# EAGLE design lte_cat_m1_shield_sara-r4 (EAGLE 9.5.1)

## Sheet 1 of 2
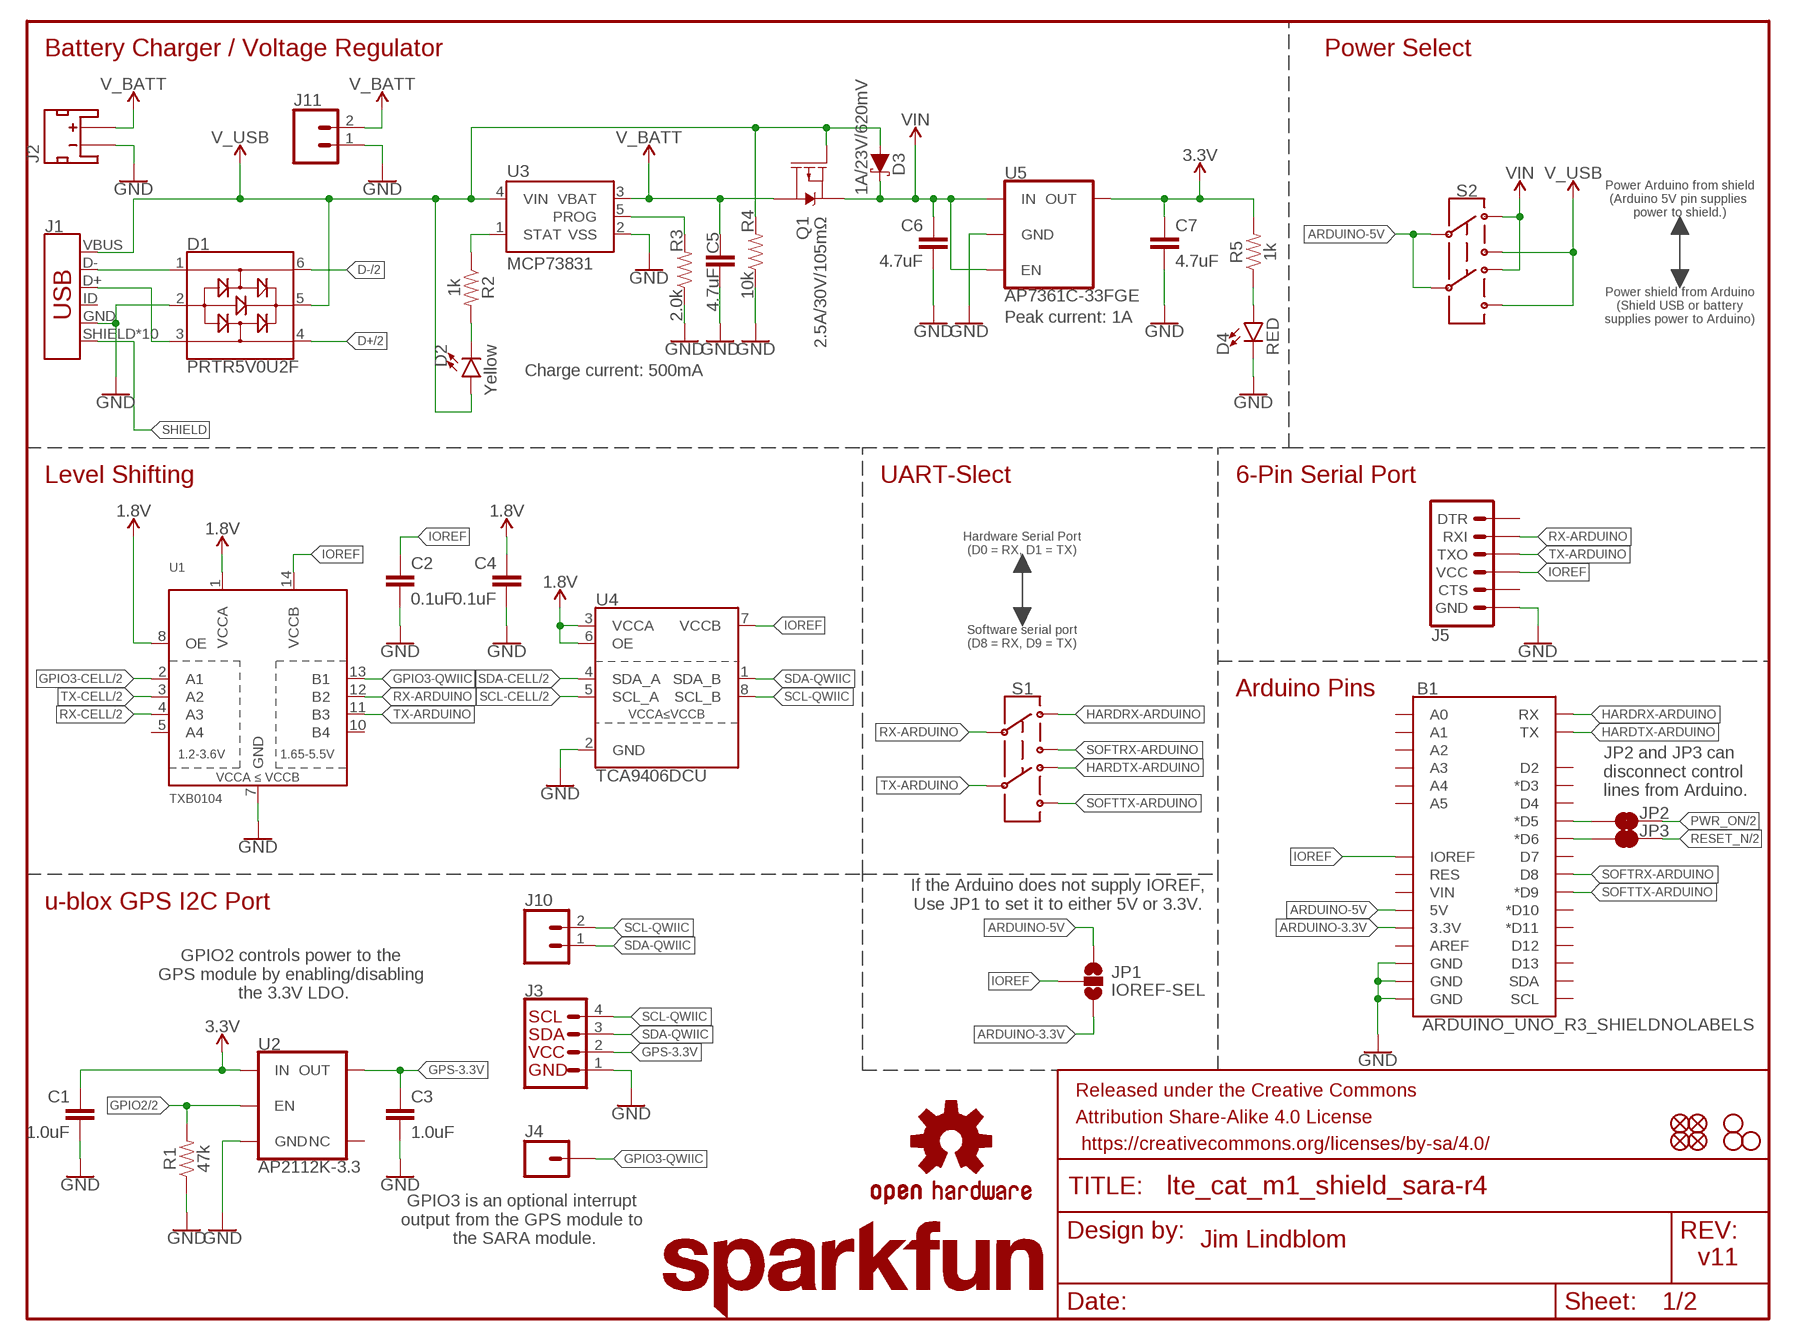
[diagram p0: schematic, sheet 1]

### Parts
B1  ARDUINO_UNO_R3_SHIELDNOLABELS  [UNO_R3_SHIELD_NOLABELS]
C1  1.0uF  1.0UF-0603-16V-10%  [0603]
C2  0.1uF  0.1UF-0603-25V-(+80/-20%)  [0603]
C3  1.0uF  1.0UF-0603-16V-10%  [0603]
C4  0.1uF  0.1UF-0603-25V-(+80/-20%)  [0603]
C5  4.7uF  4.7UF-0603-6.3V-(10%)  [0603]
C6  4.7uF  4.7UF-0603-6.3V-(10%)  [0603]
C7  4.7uF  4.7UF-0603-6.3V-(10%)  [0603]
D1  PRTR5V0U2F  [SOT886]
D2  Yellow  LED-YELLOW0603  [LED-0603]
D3  1A/23V/620mV  DIODE-SCHOTTKY-BAT20J  [SOD-323]
D4  RED  LED-RED0603  [LED-0603]
FD1  FIDUCIALUFIDUCIAL  [FIDUCIAL-MICRO]
FD2  FIDUCIALUFIDUCIAL  [FIDUCIAL-MICRO]
FD3  FIDUCIALUFIDUCIAL  [FIDUCIAL-MICRO]
FD4  FIDUCIALUFIDUCIAL  [FIDUCIAL-MICRO]
FRAME1  FRAME-LETTER  [CREATIVE_COMMONS]
H1  STAND-OFF  [STAND-OFF]
H2  STAND-OFF  [STAND-OFF]
H3  STAND-OFF  [STAND-OFF]
J1  USB_MICRO-B_HALF_PTH_MILL  [USB-MICROB-PTH-MILL]
J2  JST_2MM_MALESMD  [JST-2-SMD]
J3  QWIIC_CONNECTORJS-1MM  [1X04_1MM_RA]
J4  CONN_01PTH_NO_SILK_YES_STOP  [1X01_NO_SILK]
J5  6_PIN_SERIAL_TARGETNO_SILK  [1X06_NO_SILK]
J10  CONN_021X02_NO_SILK  [1X02_NO_SILK]
J11  CONN_021X02_NO_SILK  [1X02_NO_SILK]
JP1  IOREF-SEL  JUMPER-SMT_3_NO_SILK  [SMT-JUMPER_3_NO_SILK]
JP2  JUMPER-SMT_2_NC_TRACE_SILK  [SMT-JUMPER_2_NC_TRACE_SILK]
JP3  JUMPER-SMT_2_NC_TRACE_SILK  [SMT-JUMPER_2_NC_TRACE_SILK]
LOGO1  SFE_LOGO_NAME.2_INCH  [SFE_LOGO_NAME_.2]
LOGO2  OSHW-LOGOM  [OSHW-LOGO-M]
LOGO3  SFE_LOGO_NAME.2_INCH  [SFE_LOGO_NAME_.2]
Q1  2.5A/30V/105mΩ  MOSFET_PCH-DMG2307L  [SOT23-3]
R1  47k  47KOHM-0603-1/10W-1%  [0603]
R2  1k  1KOHM-0603-1/10W-1%  [0603]
R3  2.0k  2.0KOHM-0603-1/10W-5%  [0603]
R4  10k  10KOHM-0603-1/10W-1%  [0603]
R5  1k  1KOHM-0603-1/10W-1%  [0603]
S1  SWITCH-DPDT-SMD-AYZ0202  [SWITCH_DPDT_SMD_AYZ0202]
S2  SWITCH-DPDT-SMD-AYZ0202  [SWITCH_DPDT_SMD_AYZ0202]
U1  TXB0104  TXB0104PWR  [TSSOP14]
U2  AP2112K-3.3  V_REG_AP2112K-3.3V  [SOT23-5]
U3  MCP73831  [SOT23-5]
U4  TCA9406DCU  [VSSOP-8]
U5  AP7361C-33FGE  [8-UDFN]

### Nets
1.8V: C4.1 U1.1(VCCA) U1.8(OE) U4.3(VCCA) U4.6(OE) ; also sheet 2
3.3V: C1.1 C7.1 R5.2 U2.1(IN) U5.1(OUT) ; also sheet 2
ARDUINO-3.3V: B1.3.3V JP1.3
ARDUINO-5V: B1.5V JP1.1 S2.2 S2.5
D+ [USB_Data]: D1.4 ; also sheet 2
D- [USB_Data]: D1.6 ; also sheet 2
GND: B1.GND@0(GND) B1.GND@1(GND) B1.GND@2(GND) C1.2 C2.2 C3.2 C4.2 C5.2 C6.2 C7.2 D1.2 D4.C J1.GND J2.1(-) J3.1 J5.6(GND) J11.1 R1.1 R3.1 R4.1 U1.7(GND) U2.2(GND) U3.2(VSS) U4.2(GND) U5.4(GND) U5.EP(GND) ; also sheet 2
GPIO2: R1.2 U2.3(EN) ; also sheet 2
GPIO3-CELL: U1.2(A1) ; also sheet 2
GPIO3-QWIIC: J4.1 U1.13(B1)
GPS-3.3V: C3.1 J3.2 U2.5(OUT)
HARDRX-ARDUINO: B1.RX S1.1
HARDTX-ARDUINO: B1.TX S1.4
IOREF: B1.IOREF C2.1 J5.4(VCC) JP1.2 U1.14(VCCB) U4.7(VCCB)
N$1: R3.2 U3.5(PROG)
N$12: D1.1 J1.D-
N$14: D1.3 J1.D+
N$16: D4.A R5.1
N$17: D2.C R2.2
N$18: R2.1 U3.1(STAT)
N$19: B1.D5(*D5) JP2.1
N$20: B1.D6(*D6) JP3.1
PWR_ON: JP2.2 ; also sheet 2
RESET_N: JP3.2 ; also sheet 2
RX-ARDUINO: J5.2(RXI) S1.2 U1.12(B2)
RX-CELL: U1.4(A3) ; also sheet 2
SCL-CELL: U4.5(SCL_A) ; also sheet 2
SCL-QWIIC: J3.4 J10.2 U4.8(SCL_B)
SDA-CELL: U4.4(SDA_A) ; also sheet 2
SDA-QWIIC: J3.3 J10.1 U4.1(SDA_B)
SHIELD: J1.SHIELD J1.SHIELD2(SHIELD) J1.SHIELD3(SHIELD) J1.SHIELD4(SHIELD) J1.SHIELD5(SHIELD) J1.SHIELD6(SHIELD) J1.SHIELD7(SHIELD) J1.SHIELD8(SHIELD) J1.SHIELD9(SHIELD) J1.SHIELD10(SHIELD)
SOFTRX-ARDUINO: B1.D8 S1.3
SOFTTX-ARDUINO: B1.D9(*D9) S1.6
TX-ARDUINO: J5.3(TXO) S1.5 U1.11(B3)
TX-CELL: U1.3(A2) ; also sheet 2
V_BATT: C5.1 J2.2(+) J11.2 Q1.3(D) U3.3(VBAT)
V_USB: D1.5 D2.A D3.A J1.VBUS Q1.1(G) R4.2 S2.3 S2.6 U3.4(VIN) ; also sheet 2
VIN: C6.1 D3.C Q1.2(S) S2.1 S2.4 U5.5(EN) U5.8(IN)
Unconnected: B1.A0 B1.A1 B1.A2 B1.A3 B1.A4 B1.A5 B1.AREF B1.D2 B1.D3(*D3) B1.D4 B1.D7 B1.D10(*D10) B1.D11(*D11) B1.D12 B1.D13 B1.RES B1.SCL B1.SDA B1.VIN J1.ID J5.1(DTR) J5.5(CTS) U1.5(A4) U1.10(B4) U2.4(NC)

### Notes on the sheet
- Battery Charger / Voltage Regulator | Power Select
- Power Arduino from shield
  (Arduino 5V pin supplies 
  power to shield.)
- Power shield from Arduino
  (Shield USB or battery
  supplies power to Arduino)
- Peak current: 1A
- Charge current: 500mA
- Level Shifting | UART-Slect | 6-Pin Serial Port
- Hardware Serial Port
  (D0 = RX, D1 = TX)
- Software serial port
  (D8 = RX, D9 = TX)
- Arduino Pins
- JP2 and JP3 can
  disconnect control 
  lines from Arduino.
- u-blox GPS I2C Port
- If the Arduino does not supply IOREF,
  Use JP1 to set it to either 5V or 3.3V.
- GPIO2 controls power to the 
  GPS module by enabling/disabling 
  the 3.3V LDO.
- GPIO3 is an optional interrupt 
  output from the GPS module to 
  the SARA module.
- Jim Lindblom
- v11

## Sheet 2 of 2
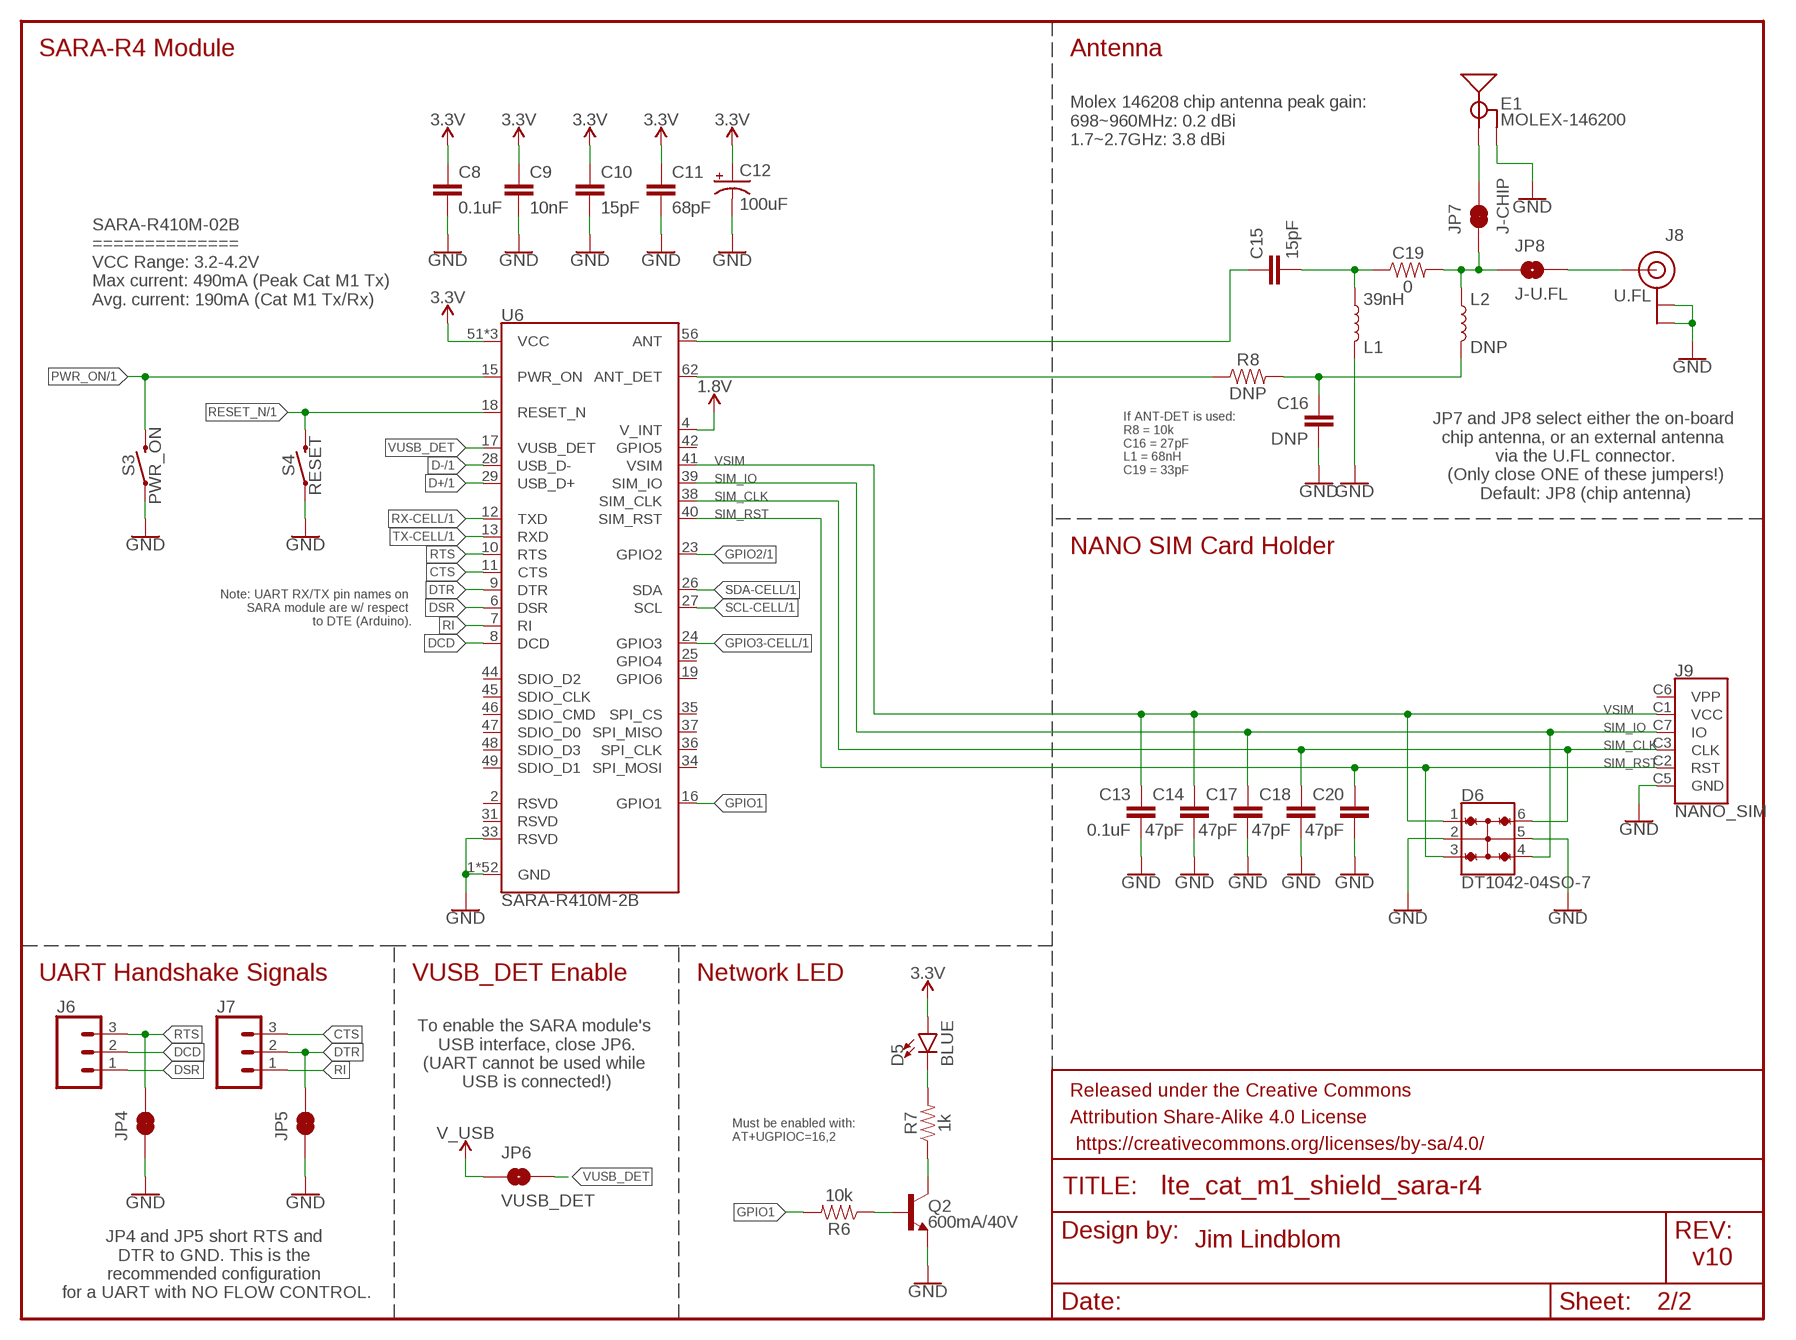
[diagram p1: schematic, sheet 2]

### Parts
C8  0.1uF  0.1UF-0603-25V-(+80/-20%)  [0603]
C9  10nF  10NF-0603-50V-10%  [0603]
C10  15pF  15PF-0603-50V-5%  [0603]
C11  68pF  68PF-0603-50V-5%  [0603]
C12  100uF  100UF-POLAR-1206-6.3V-20%  [1206-POLAR]
C13  0.1uF  0.1UF-0603-25V-(+80/-20%)  [0603]
C14  47pF  47PF-0603-50V-5%  [0603]
C15  15pF  15PF-0603-50V-5%  [0603]
C16  DNP  27PF-0603-50V-5%  [0603]
C17  47pF  47PF-0603-50V-5%  [0603]
C18  47pF  47PF-0603-50V-5%  [0603]
C19  0  0OHM-0603-1/10W-5%  [0603]
C20  47pF  47PF-0603-50V-5%  [0603]
D5  BLUE  LED-BLUE0603  [LED-0603]
D6  DT1042-04SO-7  TVS_DIODE_ARRAY_4DT1042-04SO-7  [SOT23-6L]
E1  MOLEX-146200  ANTENNA-GROUNDEDMOLEX-146200  [MOLEX_146200]
FRAME2  FRAME-LETTER  [CREATIVE_COMMONS]
J6  CONN_031X03_NO_SILK  [1X03_NO_SILK]
J7  CONN_031X03_NO_SILK  [1X03_NO_SILK]
J8  U.FL  [U.FL]
J9  NANO_SIM  NANO_SIMWURTH  [NANO_SIM_WURTH_693043020611]
JP4  JUMPER-SMT_2_NC_TRACE_SILK  [SMT-JUMPER_2_NC_TRACE_SILK]
JP5  JUMPER-SMT_2_NC_TRACE_SILK  [SMT-JUMPER_2_NC_TRACE_SILK]
JP6  VUSB_DET  JUMPER-SMT_2_NO_SILK  [SMT-JUMPER_2_NO_SILK]
JP7  J-CHIP  JUMPER-SMT_2_NC_TRACE_NO-SILK  [SMT-JUMPER_2_NC_TRACE_NO-SILK]
JP8  J-U.FL  JUMPER-SMT_2_NO_NO-SILK  [SMT-JUMPER_2_NO_NO-SILK]
L1  39nH  INDUCTOR-0603-39NH  [0603]
L2  DNP  INDUCTOR-0603-68NH  [0603]
Q2  600mA/40V  TRANS_NPN-MMBT2222AL  [SOT23-3]
R6  10k  10KOHM-0603-1/10W-1%  [0603]
R7  1k  1KOHM-0603-1/10W-1%  [0603]
R8  DNP  10KOHM-0603-1/10W-1%  [0603]
S3  PWR_ON  MOMENTARY-SWITCH-SPST-SMD-5.2-REDUNDANT  [TACTILE_SWITCH_SMD_5.2MM]
S4  RESET  MOMENTARY-SWITCH-SPST-SMD-5.2-REDUNDANT  [TACTILE_SWITCH_SMD_5.2MM]
U6  SARA-R410M-2B  SARA-R4  [SARA-LGA]

### Nets
1.8V: U6.4(V_INT) ; also sheet 1
3.3V: C8.1 C9.1 C10.1 C11.1 C12.1(+) D5.A U6.51(VCC) U6.52(VCC) U6.53(VCC) ; also sheet 1
ANT: C15.1 U6.56(ANT)
ANT_DET: R8.1 U6.62(ANT_DET)
CTS: J7.3 U6.11(CTS)
D+ [USB_Data]: U6.29(USB_D+) ; also sheet 1
D- [USB_Data]: U6.28(USB_D-) ; also sheet 1
DCD: J6.2 U6.8(DCD)
DSR: J6.1 U6.6(DSR)
DTR: J7.2 JP5.2 U6.9(DTR)
GND: C8.2 C9.2 C10.2 C11.2 C12.2(-) C13.2 C14.2 C16.2 C17.2 C18.2 C20.2 D6.2 D6.5 E1.GND J8.1(GND) J8.2(GND) J9.C5(GND) JP4.1 JP5.1 L1.1 Q2.2(E) S3.1 S3.2 S4.1 S4.2 U6.1(GND) U6.3(GND) U6.5(GND) U6.14(GND) U6.20(GND) U6.21(GND) U6.22(GND) U6.30(GND) U6.32(GND) U6.33(RSVD) U6.43(GND) U6.50(GND) U6.54(GND) U6.55(GND) U6.57(GND) U6.58(GND) U6.59(GND) U6.60(GND) U6.61(GND) U6.63(GND) U6.64(GND) U6.65(GND) U6.66(GND) U6.67(GND) U6.68(GND) U6.69(GND) U6.70(GND) U6.71(GND) U6.72(GND) U6.73(GND) U6.74(GND) U6.75(GND) U6.76(GND) U6.77(GND) U6.78(GND) U6.79(GND) U6.80(GND) U6.81(GND) U6.82(GND) U6.83(GND) U6.84(GND) U6.85(GND) U6.86(GND) U6.87(GND) U6.88(GND) U6.89(GND) U6.90(GND) U6.91(GND) U6.92(GND) U6.93(GND) U6.94(GND) U6.95(GND) U6.96(GND) ; also sheet 1
GPIO1: R6.2 U6.16(GPIO1)
GPIO2: U6.23(GPIO2) ; also sheet 1
GPIO3-CELL: U6.24(GPIO3) ; also sheet 1
N$7: C16.1 L2.2 R8.2
N$8: C15.2 C19.1 L1.2
N$9: J8.FEED(SIGNAL) JP8.2
N$10: Q2.1(B) R6.1
N$13: D5.C R7.2
N$15: Q2.3(C) R7.1
N$21: C19.2 JP7.1 JP8.1 L2.1
N$22: E1.FEED(SIGNAL) JP7.2
PWR_ON: S3.3 S3.4 U6.15(PWR_ON) ; also sheet 1
RESET_N: S4.3 S4.4 U6.18(RESET_N) ; also sheet 1
RI: J7.1 U6.7(RI)
RTS: J6.3 JP4.2 U6.10(RTS)
RX-CELL: U6.12(TXD) ; also sheet 1
SCL-CELL: U6.27(SCL) ; also sheet 1
SDA-CELL: U6.26(SDA) ; also sheet 1
SIM_CLK: C18.1 D6.6 J9.C3(CLK) U6.38(SIM_CLK)
SIM_IO: C17.1 D6.4 J9.C7(IO) U6.39(SIM_IO)
SIM_RST: C20.1 D6.3 J9.C2(RST) U6.40(SIM_RST)
TX-CELL: U6.13(RXD) ; also sheet 1
V_USB: JP6.1 ; also sheet 1
VSIM: C13.1 C14.1 D6.1 J9.C1(VCC) U6.41(VSIM)
VUSB_DET: JP6.2 U6.17(VUSB_DET)
Unconnected: J9.C6(VPP) U6.2(RSVD) U6.19(GPIO6) U6.25(GPIO4) U6.31(RSVD) U6.34(SPI_MOSI) U6.35(SPI_CS) U6.36(SPI_CLK) U6.37(SPI_MISO) U6.42(GPIO5) U6.44(SDIO_D2) U6.45(SDIO_CLK) U6.46(SDIO_CMD) U6.47(SDIO_D0) U6.48(SDIO_D3) U6.49(SDIO_D1)

### Notes on the sheet
- SARA-R4 Module | Antenna
- Molex 146208 chip antenna peak gain: 
  698~960MHz: 0.2 dBi
  1.7~2.7GHz: 3.8 dBi
- SARA-R410M-02B
  ==============
  VCC Range: 3.2-4.2V
  Max current: 490mA (Peak Cat M1 Tx)
  Avg. current: 190mA (Cat M1 Tx/Rx)
- If ANT-DET is used:
  R8 = 10k
  C16 = 27pF
  L1 = 68nH
  C19 = 33pF
- JP7 and JP8 select either the on-board 
  chip antenna, or an external antenna 
  via the U.FL connector.
  (Only close ONE of these jumpers!)
  Default: JP8 (chip antenna)
- NANO SIM Card Holder
- Note: UART RX/TX pin names on 
  SARA module are w/ respect 
  to DTE (Arduino).
- UART Handshake Signals | VUSB_DET Enable | Network LED
- To enable the SARA module's 
  USB interface, close JP6.
  (UART cannot be used while 
  USB is connected!)
- Must be enabled with:
  AT+UGPIOC=16,2
- JP4 and JP5 short RTS and 
  DTR to GND. This is the 
  recommended configuration 
  for a UART with NO FLOW CONTROL.
- Jim Lindblom
- v10

## Library data of the parts
B1 = SparkFun-Boards:ARDUINO_UNO_R3_SHIELD: Arduino R3 Shield Footprint Shield form compatible with the Arduino Uno R3. SparkFun Products: MG2639 Cellular Shield <https://www.sparkfun.com/products/13120> MIDI Shield <https://www.sparkfun.com/products/12898> R3 Stackable Headers Kit <https://www.sparkfun.com/products/11417>
C1 C3 = SparkFun-Capacitors:1.0UF: 1µF ceramic capacitors A capacitor is a passive two-terminal electrical component used to store electrical energy temporarily in an electric field.; PROD_ID: CAP-00868
C2 C4 C8 C13 = SparkFun-Capacitors:0.1UF: 0.1µF ceramic capacitors A capacitor is a passive two-terminal electrical component used to store electrical energy temporarily in an electric field.; PROD_ID: CAP-00810
C5-C7 = SparkFun-Capacitors:4.7UF: 4.7µF ceramic capacitors A capacitor is a passive two-terminal electrical component used to store electrical energy temporarily in an electric field.; PROD_ID: CAP-08280
C9 = SparkFun-Capacitors:10NF: 0.01uF/10nF/10,000pF ceramic capacitors A capacitor is a passive two-terminal electrical component used to store electrical energy temporarily in an electric field. CAP-09321; PROD_ID: CAP-00867
C10 C15 = SparkFun-Capacitors:15PF: 15pF ceramic capacitors A capacitor is a passive two-terminal electrical component used to store electrical energy temporarily in an electric field.; PROD_ID: CAP-07881
C11 = ublox:68PF: 68pF ceramic capacitors A capacitor is a passive two-terminal electrical component used to store electrical energy temporarily in an electric field.; PROD_ID: CAP-14092
C12 = ublox:100UF-POLAR: 100µF polarized capacitors A capacitor is a passive two-terminal electrical component used to store electrical energy temporarily in an electric field.; PROD_ID: CAP-14093
C14 C17 C18 C20 = SparkFun-Capacitors:47PF: 47pF ceramic capacitors A capacitor is a passive two-terminal electrical component used to store electrical energy temporarily in an electric field.; PROD_ID: CAP-08913
C16 = SparkFun-Capacitors:27PF: 27pF ceramic capacitors A capacitor is a passive two-terminal electrical component used to store electrical energy temporarily in an electric field.; PROD_ID: CAP-09989; VALUE: 27pF
C19 = SparkFun-Resistors:0OHM: 0Ω resistor A resistor is a passive two-terminal electrical component that implements electrical resistance as a circuit element. Resistors act to reduce current flow, and, at the same time, act to lower voltage levels within circuits. - Wikipedia; PROD_ID: RES-08609
D1 = ublox:PRTR5V0U2; PROD_ID: DIO-14084
D2 = SparkFun-LED:LED-YELLOW: Yellow SMD LED Used in manufacturing several products at SparkFun. Packages: 0603 - SMD 0603 package[Product Link] <http://www.kingbrightusa.com/product.asp?catalog_name=LED&product_id=APT1608SYCK> 0603 -SMART - SMART SMD 0603 package (more efficient/more expensive) [Product Link] <http://www.osram-os.com/osram_os/en/products/product-catalog/led-light-emitting-diodes/smartled-0603/ly-l29k/index.jsp> LilyPad - SMD1206 package[Product Datasheet] <https://www.sparkfun.com/datasheets/DevTools/LilyPad/Q150YUS4.pdf> SparkFun Products: Blynk Board <https://www.sparkfun.com/products/13794> IOIO-OTG <https://www.sparkfun.com/products/13613> XBee Explorer Serial <https://www.sparkfun.com/products/13225>; PROD_ID: DIO-09003
D3 = SparkFun-DiscreteSemi:DIODE-SCHOTTKY: Schottky diode A Schottky diode is a semiconductor diode which has a low forward voltage drop and a very fast switching action.; PROD_ID: DIO-11623
D4 = SparkFun-LED:LED-RED: Red SMD LED Used in manufacturing of most products at SparkFun Packages: 0603 - SMD 0603 package [Product Link] <http://docs.avagotech.com/docs/AV02-0551EN> 0603 SMART - SMD 0603 SMART package ( more efficient and expensive)[Product Link] <http://www.osram-os.com/Graphics/XPic2/00077099_0.pdf> 1206 - SMD1206 package [Product Link] <https://www.sparkfun.com/datasheets/DevTools/LilyPad/Q150OVS4.pdff> SparkFun Products: Pro Mini 328 -5V <https://www.sparkfun.com/products/821> RedBoard <https://www.sparkfun.com/products/12757> IOIO-OTG <https://www.sparkfun.com/products/13613>; PROD_ID: DIO-00819
D5 = SparkFun-LED:LED-BLUE: Blue SMD LED Used in manufacturing of various products at SparkFun Packages: 0603 - SMD 0603 package [Product Link] <http://www.digikey.com/product-detail/en/SMLE12BC7TT86/511-1589-2-ND/1641808> 1206 - SMD1206 package [Product Link] <http://www.digikey.com/product-detail/en/lite-on-inc/LTST-C150TBKT/160-1643-1-ND/573584> SparkFun Products: ESP8266 Thing-Dev Board <https://www.sparkfun.com/products/13711> RedBoard <https://www.sparkfun.com/products/12757>; PROD_ID: DIO-08575
D6 = ublox:TVS_DIODE_ARRAY_4; PROD_ID: DIO-14095
E1 = ublox:ANTENNA-GROUNDED: Antenna w/ Ground Connection 2.4GHz antennae with signal and ground terminals. TRACE_ANTENNA_2.4GHZ_15.2MM - Meander Trace antenna 15.2 x 5.7mm footprint Based on layout from TI app note AN043 <http://www.ti.com/lit/an/swra117d/swra117d.pdf>. TRACE_ANTENNA_2.4GHZ_25.7MM - Inverted F trace antenna 25.7 x 7.5 mm footprint. Based on layout from TI design note DN0007 <http://www.ti.com/lit/an/swru120b/swru120b.pdf>.; PROD_ID: ANT-14096
FD1-FD4 = SparkFun-Aesthetics:FIDUCIAL: Fiducial Alignment Points Point-of-reference for pick-and-place machines and other optical instruments.
FRAME1 FRAME2 = SparkFun-Aesthetics:FRAME-LETTER: Schematic Frame - Letter Standard 8.5x11 US Letter frame
H1-H3 = SparkFun-Hardware:STAND-OFF: Stand Off Drill holes for mechanically mounting via screws, standoffs, etc. Note: Use the keepout ring to avoid running the screw head into surrounding components. Variant Overviews STAND-OFF - Mechanical footprint for a #4 phillips button head screw. STAND-OFF-TIGHT - Mechanical footprint for a #4 phillips button head screw, Example SparkFun Products Screw - Phillips Head (1/4", 4-40, 10 pack) <https://www.sparkfun.com/products/10453> (PRT-10453) Screw - Phillips Head (1/2", 4-40, 10 pack) <https://www.sparkfun.com/products/10452> (PRT-10452) Screw - Phillips Head (3/4", 4-40, 10 pack) <https://www.sparkfun.com/products/10451> (PRT-10451) Screw - Phillips Head (1", 4-40, 10 pack) <https://www.sparkfun.com/products/10450> (PRT-10450)
J1 = SparkFun-Connectors:USB_MICRO-B: USB Type Micro-B Connector Male/female and PTH/SMT variants SparkFun Products: SparkFun microB USB Breakout <https://www.sparkfun.com/products/12035> SparkFun USB microB Plug Breakout <https://www.sparkfun.com/products/10031> SparkFun ESP8266 Thing <https://www.sparkfun.com/products/13231>; PROD_ID: CONN-13711
J2 = SparkFun-Connectors:JST_2MM_MALE: JST 2MM MALE RA CONNECTOR Two pin, compact surface mount connector. Commonly used as a battery input connection point. We really like the solid locking feeling and high current rating on these small connectors. We use these all the time as battery connectors. Mates to single-cell LiPo batteries. Here is the connector we sell at SparkFun: JST Right Angle Connector - White <https://www.sparkfun.com/products/8612> (PRT-08612) Datasheet <http://www.sparkfun.com/datasheets/Prototyping/Connectors/JST-Horizontal.pdf> It was used on these SparkFun products: SparkFun MOSFET Power Controller <https://www.sparkfun.com/products/11214> (PRT-11214) SparkFun Battery Babysitter - LiPo Battery Manager <https://www.sparkfun.com/products/13777> (PRT-13777) And many, many others that required a lipo battery connection.; PROD_ID: CONN-11443; SF_ID: PRT-08612
J3 = SparkFun-Connectors:QWIIC_CONNECTOR: SparkFun I2C Standard Qwiic Connector An SMD 1mm pitch JST connector makes it easy and quick (get it? Qwiic?) to connect I2C devices to each other. The Qwiic system <http://www.sparkfun.com/qwiic> enables fast and solderless connection between popular platforms and various sensors and actuators. We carry 200mm <https://www.sparkfun.com/products/14204>, 100mm <https://www.sparkfun.com/products/14205>, 50mm <https://www.sparkfun.com/products/14206>, and breadboard friendly <https://www.sparkfun.com/products/14207> Qwiic cables. We also offer 10 pcs strips <https://www.sparkfun.com/products/14323> the SMD connectors.; PROD_ID: CONN-13694
J4 = SparkFun-Connectors:CONN_01: Single connection point. Often used as Generic Header-pin footprint for 0.1 inch spaced/style header connections On any of the 0.1 inch spaced packages, you can populate with these: Break Away Headers - Straight <https://www.sparkfun.com/products/116> (PRT-00116) Break Away Male Headers - Right Angle <https://www.sparkfun.com/products/553> (PRT-00553) Female Headers <https://www.sparkfun.com/products/115> (PRT-00115) Break Away Headers - Machine Pin <https://www.sparkfun.com/products/117> (PRT-00117) Break Away Female Headers - Swiss Machine Pin <https://www.sparkfun.com/products/743> (PRT-00743) This device is also useful as a general connection point to wire up your design to another part of your project. Our various solder wires solder well into these plated through hole pads. Hook-Up Wire - Assortment (Stranded, 22 AWG) <https://www.sparkfun.com/products/11375> (PRT-11375) Hook-Up Wire - Assortment (Solid Core, 22 AWG) <https://www.sparkfun.com/products/11367> (PRT-11367) View the entire wire category on our website here <https://www.sparkfun.com/categories/141> Special notes: SMTSO-256-ET is a "flush mount" nut for a 4-40 screw. We mostly use this on specialty testbeds; it is a nice way to connect hardware to your PCB at an adjustable hieght. Also note, the SNAP packages are for using a snappable style connector. We sell a baggie of snaps and they are also used on two LilyPad designs: Snap Assortment - 30 pack (male and female) <https://www.sparkfun.com/products/11347> (DEV-11347) LilyPad Arduino SimpleSnap <https://www.sparkfun.com/products/10941> (DEV-10941) LilyPad SimpleSnap Protoboard <https://www.sparkfun.com/products/10940> (DEV-10940)
J5 = SparkFun-Connectors:6_PIN_SERIAL_TARGET: 6-pin header connection for use with the "FTDI BASIC" pinout - TARGET SIDE. Also known as "Arduino Serial Program Header". It is used to mate with our FTDI Basic serial programmers using the Arduino IDE. Note, this device has "TARGET" in the name. It is intended to be used on a design that contains a target micro-controller that you wish to program. The "sister" device, named "CABLE" is inteneded to be used on a design that usually lives on the end of your USB cable and prvides the converter chip (FTDI232 or FTDI231x) to commnicate serial RX/TX. You can populate with some of these: Break Away Headers - Straight <https://www.sparkfun.com/products/116> (PRT-00116) For reference (or to suit your programming needs) check out these designs: SparkFun FTDI Basic Breakout - 5V <https://www.sparkfun.com/products/9716> (DEV-09716) SparkFun FTDI Basic Breakout - 3.3V <https://www.sparkfun.com/products/9873> (DEV-09873) SparkFun FTDI SmartBasic <https://www.sparkfun.com/products/12935> (DEV-12935) SparkFun Beefy 3 - FTDI Basic Breakout <https://www.sparkfun.com/products/13746> (DEV-13746)
J6 J7 = SparkFun-Connectors:CONN_03: Multi connection point. Often used as Generic Header-pin footprint for 0.1 inch spaced/style header connections On any of the 0.1 inch spaced packages, you can populate with these: Break Away Headers - Straight <https://www.sparkfun.com/products/116> (PRT-00116) Break Away Male Headers - Right Angle <https://www.sparkfun.com/products/553> (PRT-00553) Female Headers <https://www.sparkfun.com/products/115> (PRT-00115) Break Away Headers - Machine Pin <https://www.sparkfun.com/products/117> (PRT-00117) Break Away Female Headers - Swiss Machine Pin <https://www.sparkfun.com/products/743> (PRT-00743) Stackable Header - 3 Pin (Female, 0.1") <https://www.sparkfun.com/products/13875> (PRT-13875) For SCREWTERMINALS and SPRING TERMINALS visit here: Screw Terimnals on SparkFun.com <https://www.sparkfun.com/search/results?term=Screw+Terminals> (5mm/3.5mm/2.54mm spacing) This device is also useful as a general connection point to wire up your design to another part of your project. Our various solder wires solder well into these plated through hole pads. Hook-Up Wire - Assortment (Stranded, 22 AWG) <https://www.sparkfun.com/products/11375> (PRT-11375) Hook-Up Wire - Assortment (Solid Core, 22 AWG) <https://www.sparkfun.com/products/11367> (PRT-11367) View the entire wire category on our website here <https://www.sparkfun.com/categories/141> Special notes: Molex polarized connector foot print use with SKU : PRT-08232 with associated crimp pins and housings.
J8 = SparkFun-Connectors:U.FL: SMD Antenna Connector - U.FL 2mm height, 3.0mm x 3.0mm receptacle size. SparkFun Products: SparkFun WiFi Shield - ESP8266 <https://www.sparkfun.com/products/13287> SparkFun ESP8266 Thing <https://www.sparkfun.com/products/13231> SparkFun MiniGen - Pro Mini Signal Generator Shield <https://www.sparkfun.com/products/11420>; PROD_ID: CONN-09193; SF_ID: WRL-09144
J9 = ublox:NANO_SIM; PROD_ID: CONN-14097
J10 J11 = SparkFun-Connectors:CONN_02: Multi connection point. Often used as Generic Header-pin footprint for 0.1 inch spaced/style header connections On any of the 0.1 inch spaced packages, you can populate with these: Break Away Headers - Straight <https://www.sparkfun.com/products/116> (PRT-00116) Break Away Male Headers - Right Angle <https://www.sparkfun.com/products/553> (PRT-00553) Female Headers <https://www.sparkfun.com/products/115> (PRT-00115) Break Away Headers - Machine Pin <https://www.sparkfun.com/products/117> (PRT-00117) Break Away Female Headers - Swiss Machine Pin <https://www.sparkfun.com/products/743> (PRT-00743) For SCREWTERMINALS and SPRING TERMINALS visit here: Screw Terimnals on SparkFun.com <https://www.sparkfun.com/search/results?term=Screw+Terminals> (5mm/3.5mm/2.54mm spacing) This device is also useful as a general connection point to wire up your design to another part of your project. Our various solder wires solder well into these plated through hole pads. Hook-Up Wire - Assortment (Stranded, 22 AWG) <https://www.sparkfun.com/products/11375> (PRT-11375) Hook-Up Wire - Assortment (Solid Core, 22 AWG) <https://www.sparkfun.com/products/11367> (PRT-11367) View the entire wire category on our website here <https://www.sparkfun.com/categories/141> Special notes: Molex polarized connector foot print use with: PRT-08233 with associated crimp pins and housings. 2.54_SCREWTERM for use with PRT-10571. 3.5mm Screw Terminal footprints for PRT-08084 5mm Screw Terminal footprints for use with PRT-08432
JP1 = SparkFun-Jumpers:JUMPER-SMT_3_NO: Normally open jumper This jumper has three pads in close proximity to each other. Apply solder to close the connection(s).
JP2-JP5 JP7 = SparkFun-Jumpers:JUMPER-SMT_2_NC_TRACE: Normally closed trace jumper This jumper has a trace between two pads so it's normally closed (NC). Use a razor knife to open the connection. For best results follow the IPC guidelines for cutting traces: Cutout at least 0.063 mm (0.005 in). Remove all loose material to clean up the cut area. Seal the cut with an approved epoxy. Reapply solder to reclose the connection.
JP6 JP8 = SparkFun-Jumpers:JUMPER-SMT_2_NO: Normally open jumper This jumper has two pads in close proximity to each other. Apply solder to close the connection. Round pads are easier to solder for beginners, but are a lot larger. SparkFun Product that uses the round pads: SparkFun EL Sequencer <https://www.sparkfun.com/products/12781>
L1 = ublox:INDUCTOR: Inductors Resist changes in electrical current. Basically a coil of wire. SparkFun Products: SparkFun Load Cell Amplifier - HX711 <https://www.sparkfun.com/products/13879> IOIO-OTG - V2.2 <https://www.sparkfun.com/products/13613>; PROD_ID: NDUC-14091
L2 = ublox:INDUCTOR: Inductors Resist changes in electrical current. Basically a coil of wire. SparkFun Products: SparkFun Load Cell Amplifier - HX711 <https://www.sparkfun.com/products/13879> IOIO-OTG - V2.2 <https://www.sparkfun.com/products/13613>; VALUE: 68nH
LOGO1 LOGO3 = SparkFun-Aesthetics:SFE_LOGO_NAME: SparkFun Font Logo This is the SparkFun name logo. The logo on the schematic will always be the same size; the package variant is the height of the flame part of the logo (or the height the flame would be, if it were drawn). Default layer for the logo on the board is tSilk.
LOGO2 = SparkFun-Aesthetics:OSHW-LOGO: Open-Source Hardware (OSHW) Logo This logo indicates the piece of hardware it is found on incorporates a OSHW license and/or adheres to the definition of open source hardware found here: http://freedomdefined.org/OSHW
Q1 = SparkFun-DiscreteSemi:MOSFET_PCH: P-channel MOSFETs Voltage controlled devices that allow control of high current outputs. SparkFun Products: SparkFun ESP32 Thing <https://www.sparkfun.com/products/13907> SparkFun ESP8266 Thing <https://www.sparkfun.com/products/13231>; PROD_ID: TRANS-11308
Q2 = SparkFun-DiscreteSemi:TRANS_NPN: NPN transistor Current controlled devices typically used to amplify current or used as a switch. BC547 - COM-08928 <http://www.sparkfun.com/products/8928> (TO-92 45V 100mA) (1.Collector 2.Base 3.Emitter) 2N3904 - COM-00521 <http://www.sparkfun.com/products/521> (TO-92 40V 200mA) (1.Emitter 2.Base 3.Collector) P2N2222A - COM-12852 <http://www.sparkfun.com/products/12852> (TO-92 40V 600mA) (1.Collector 2.Base 3.Emitter); PROD_ID: TRANS-08049
R1 = SparkFun-Resistors:47KOHM: 47kΩ resistor A resistor is a passive two-terminal electrical component that implements electrical resistance as a circuit element. Resistors act to reduce current flow, and, at the same time, act to lower voltage levels within circuits. - Wikipedia; PROD_ID: RES-07871
R2 R5 R7 = SparkFun-Resistors:1KOHM: 1kΩ resistor A resistor is a passive two-terminal electrical component that implements electrical resistance as a circuit element. Resistors act to reduce current flow, and, at the same time, act to lower voltage levels within circuits. - Wikipedia; PROD_ID: RES-07856
R3 = SparkFun-Resistors:2.0KOHM: 2kΩ resistor A resistor is a passive two-terminal electrical component that implements electrical resistance as a circuit element. Resistors act to reduce current flow, and, at the same time, act to lower voltage levels within circuits. - Wikipedia; PROD_ID: RES-08296
R4 R6 = SparkFun-Resistors:10KOHM: 10kΩ resistor A resistor is a passive two-terminal electrical component that implements electrical resistance as a circuit element. Resistors act to reduce current flow, and, at the same time, act to lower voltage levels within circuits. - Wikipedia; PROD_ID: RES-00824
R8 = SparkFun-Resistors:10KOHM: 10kΩ resistor A resistor is a passive two-terminal electrical component that implements electrical resistance as a circuit element. Resistors act to reduce current flow, and, at the same time, act to lower voltage levels within circuits. - Wikipedia; PROD_ID: RES-00824; VALUE: 10k
S1 S2 = SparkFun-Switches:SWITCH-DPDT: Double-Pole, Double-Throw (DPDT) Switch Double-pole, double-throw switches. Variant Overview PTH-GPI-152-3013 Used on SparkFun Geiger Counter <https://www.sparkfun.com/products/11345> SMD-AY0202 Surface Mount DPDT Switch <https://www.sparkfun.com/products/597> (COM-00597) Used on e.g. LilyPad Arduino USB - ATmega32U4 Board <https://www.sparkfun.com/products/12049>; PROD_ID: SWCH-08179; SF_SKU: COM-00597
S3 S4 = SparkFun-Switches:MOMENTARY-SWITCH-SPST: Momentary Switch (Pushbutton) - SPST Normally-open (NO) SPST momentary switches (buttons, pushbuttons). Variants PTH-12MM - 12mm square, through-hole Momentary Pushbutton Switch - 12mm Square <https://www.sparkfun.com/products/9190> (COM-09190) PTH-6.0MM, PTH-6.0MM-KIT - 6.0mm square, through-hole Mini Pushbutton Switch <https://www.sparkfun.com/products/97> (COM-00097) KIT package intended for soldering kit's - only one side of pads' copper is exposed. PTH-RIGHT-ANGLE-KIT - Right-angle, through-hole Right Angle Tactile Button <https://www.sparkfun.com/products/10791> - Used on SparkFun BigTime Watch Kit <https://www.sparkfun.com/products/11734> SMD-12MM - 12mm square, surface-mount Tactile Button - SMD (12mm) <https://www.sparkfun.com/products/12993> (COM-12993) Used on SparkFun PicoBoard <https://www.sparkfun.com/products/11888> SMD-4.5MM - 4.5mm Square Trackball Switch Used on SparkFun Blackberry Trackballer Breakout <https://www.sparkfun.com/products/13169> SMD-4.6MMX2.8MM - 4.60mm x 2.80mm, surface mount Used on SparkFun SAMD21 Mini Breakout <https://www.sparkfun.com/products/13664> SMD-5.2MM, SMD-5.2-REDUNDANT - 5.2mm square, surface-mount Mini Pushbutton Switch - SMD <https://www.sparkfun.com/products/8720> (COM-08720) Used on Arduino Pro Mini <https://www.sparkfun.com/products/11114> REDUNDANT package connects both switch circuits together SMD-6.0X3.5MM - 6.0 x 3.5mm, surface mount Momentary Reset Switch SMD <https://www.sparkfun.com/products/8229> (COM-08229) SMD-6.2MM-TALL - 6.2mm square, surface mount Tactile Button - SMD (6mm) <https://www.sparkfun.com/products/12992> Used on SparkFun Digital Sandbox <https://www.sparkfun.com/products/12651> SMD-RIGHT-ANGLE - Right-angle, surface mount Used on SparkFun Block for Intel® Edison - Arduino <https://www.sparkfun.com/products/13036>; PROD_ID: SWCH-08247; SF_SKU: COM-08720
U1 = SparkFun-IC-Comms:TXB0104PWR: 4-Bit Bi-Directional Level Shifter 1.2V-3.6V (VCCA) to 1.65V-5.5V (VCCB) bi-directional level shifter with auto direction sensing. Max data rate - VCCA 1.8V: 20Mbps (50ns), VCCA 3.3V: 100Mbps (10ns) Digikey: 296-21929-1-ND (TSSOP) Datasheet <http://cdn.sparkfun.com/datasheets/BreakoutBoards/txb0104.pdf> SparkFun Products SparkFun Cellular Shield - MG2639 <https://www.sparkfun.com/products/13120> (CEL-13120) SparkFun Level Shifting microSD Breakout <https://www.sparkfun.com/products/13743> (DEV-13743) SparkFun Voltage-Level Translator Breakout - TXB0104 <https://www.sparkfun.com/products/11771> (BOB-11771) SparkFun Block for Intel® Edison - UART <https://www.sparkfun.com/products/13040> (DEV-13040) SparkFun Block for Intel® Edison - Arduino <https://www.sparkfun.com/products/13036> (DEV-13036); PROD_ID: IC-13929
U2 = SparkFun-IC-Power:V_REG_AP2112: AP2112 - 600mA CMOS LDO Regulator w/ Enable The AP2112 is CMOS process low dropout linear regulator with enable function, the regulator delivers a guaranteed 600mA (min.) continuous load current. Features Output Voltage Accuracy: ±1.5% Output Current: 600mA (Min.) Foldback Short Current Protection: 50mA Enable Function to Turn ON/OFF VOUT Low Dropout Voltage (3.3V): 250mV (Typ.) @IOUT=600mA Excellent Load Regulation: 0.2%/A (Typ.) Excellent Line Regulation: 0.02%/V (Typ.) Low Quiescent Current: 55μA (Typ.) Low Standby Current: 0.01μA (Typ.) Low Output Noise: 50μVRMS PSRR: 100Hz -65dB, 1kHz -65dB OTSD Protection Stable with 1.0μF Flexible Cap: Ceramic, Tantalum and Aluminum Electrolytic Operation Temperature Range: -40°C to 85°C ESD: MM 400V, HBM 4000V; PROD_ID: VREG-12457; VALUE: 3.3V
U3 = SparkFun-PowerIC:MCP73831: Miniature single cell, fully integrated Li-Ion, Li-polymer charge management controller http://ww1.microchip.com/downloads/en/DeviceDoc/21984a.pdf IC-09995; PROD_ID: IC-09995
U4 = ublox:TCA9406; PROD_ID: IC-14098
U5 = ublox:AP7361C-33FGE: AP7361C 3.3V LDO Regulator; PROD_ID: VREG-14094
U6 = ublox:SARA-R4; PROD_ID: IC-14085

## Net classes
1 USB_Data: width 0.152 mm, drill 0.305 mm, clearance 0.152 mm

## Board
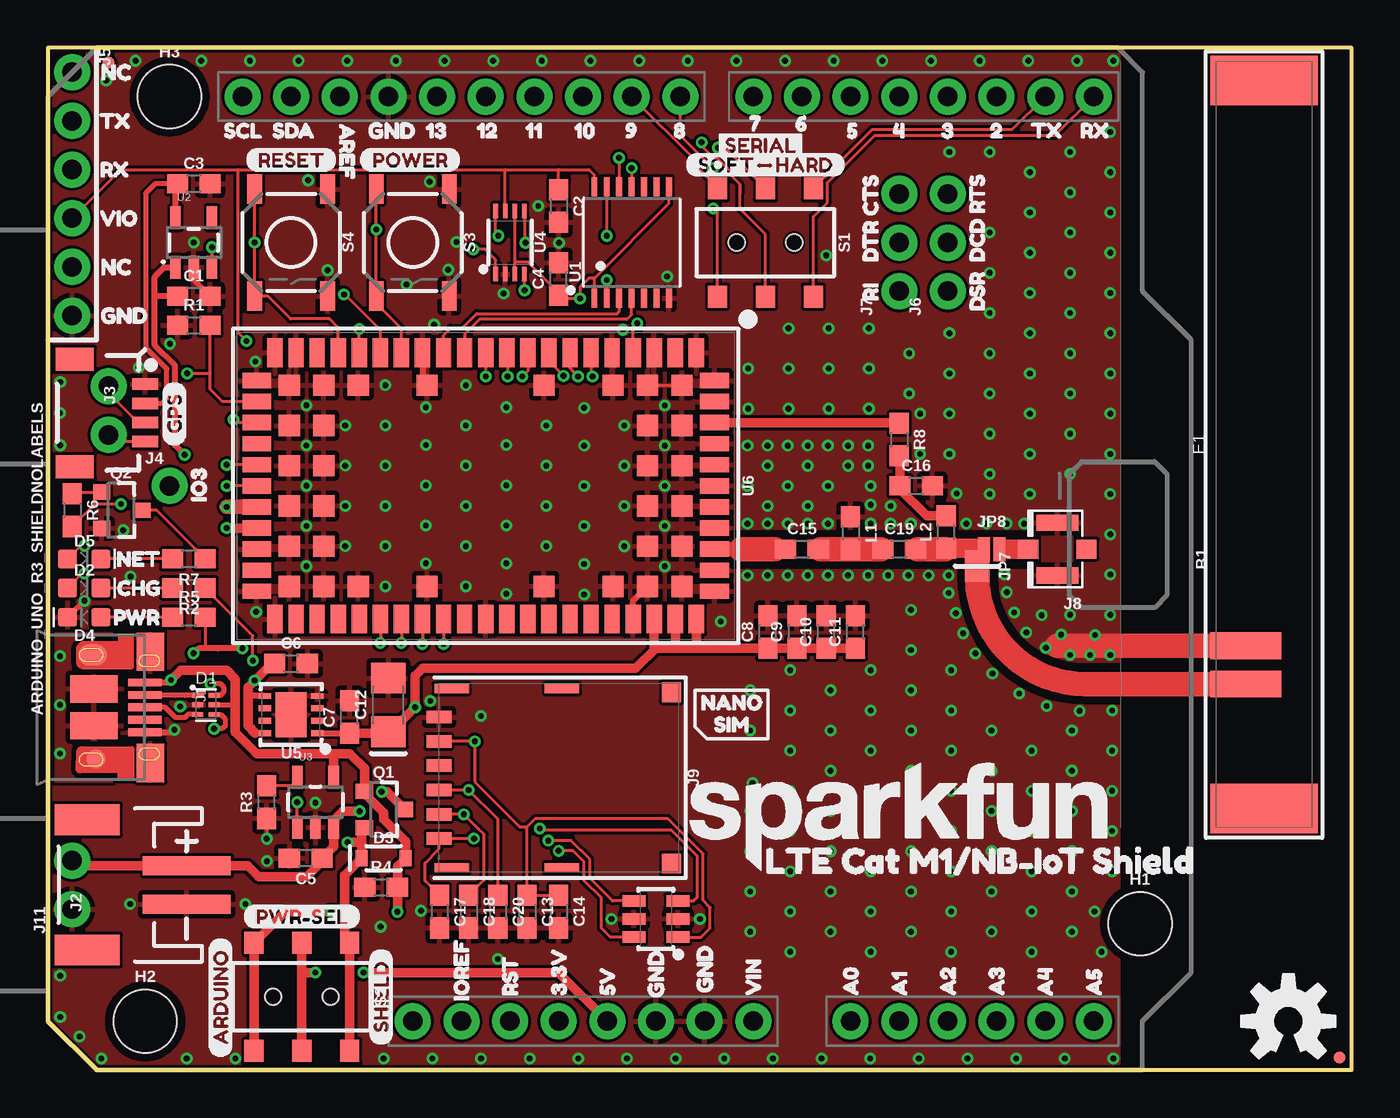
[diagram p2: board, top side]
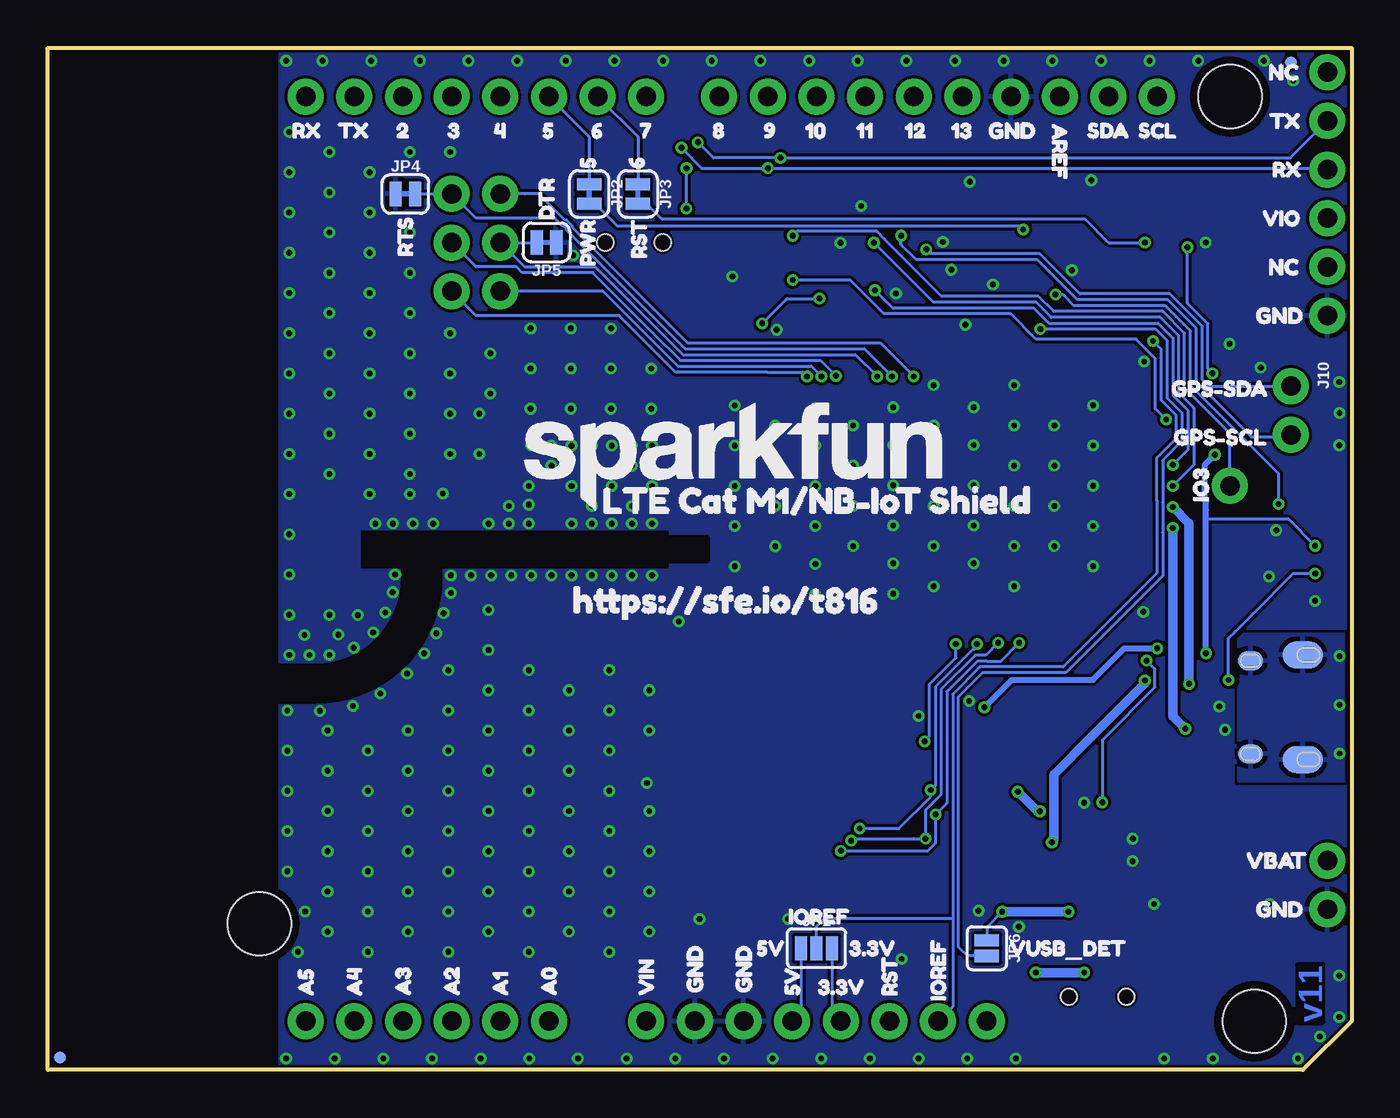
[diagram p3: board, bottom side, seen from below]

Size 68.07 x 53.34 mm. Coordinates in mm from the lower left corner, seen from the top.
Outline: 0,2.54 2.54,0 68.07,0 68.07,53.34 0,53.34 0,2.54
Copper layers (1*16): Top 0.035mm / dielectric 1.5mm / Bottom 0.035mm
Design rules "SparkFun-2-layer-PCBWay-LIMIT": minimum track width 6mil, minimum drill 0.3mm, track to track 6mil, track to pad 6mil, pad to pad 6mil, via to via 6mil, smd to smd 6mil, copper to edge 6mil, drill to drill 6mil, minimum pad ring 6mil, minimum via ring 6mil, stop-mask expansion 4mil, vias tented up to drill 25mil, thermal gap 10mil

### Footprints (pad centres in the part's own frame; a part is rotated, then mirrored left to right if it is on the bottom)
UNO_R3_SHIELD_NOLABELS = drill 1.016 pad 1.88: 3.3V 24.13,-3.81; 5V 24.13,-1.27; A0 24.13,11.43; A1 24.13,13.97; A2 24.13,16.51; A3 24.13,19.05; A4 24.13,21.59; A5 24.13,24.13; AREF -24.13,-15.24; D2 -24.13,19.05; D3 -24.13,16.51; D4 -24.13,13.97; D5 -24.13,11.43; D6 -24.13,8.89; D7 -24.13,6.35; D8 -24.13,2.54; D9 -24.13,0; D10 -24.13,-2.54; D11 -24.13,-5.08; D12 -24.13,-7.62; D13 -24.13,-10.16; GND@0 24.13,1.27; GND@1 24.13,3.81; GND@2 -24.13,-12.7; IOREF 24.13,-8.89; NC 24.13,-11.43; RES 24.13,-6.35; RX -24.13,24.13; SCL -24.13,-20.32; SDA -24.13,-17.78; TX -24.13,21.59; VIN 24.13,6.35
0603 = smd 1.1 x 1: 1 -0.85,0; 2 0.85,0
1206-POLAR = smd 1.6 x 1.8: 1 -1.4,0; 2 1.4,0
SOT886 = smd 0.61 x 0.25: 1 -0.405,0.5 | smd 0.56 x 0.25: 2 -0.43,0; 3 -0.43,-0.5; 4 0.43,-0.5; 5 0.43,0; 6 0.43,0.5
LED-0603 = smd 1 x 1: A -0.877,0; C 0.877,0
SOD-323 = smd 0.63 x 0.83: A 1.15,0; C -1.15,0
SOT23-6L = smd 0.6 x 1.2: 1 -0.95,-1.15; 2 0,-1.15; 3 0.95,-1.15; 4 0.95,1.15; 5 0,1.15; 6 -0.95,1.15
MOLEX_146200 = smd 1.4 x 3.7: FEED 12.5,-0.95; GND 10.5,-0.95 | smd 2.6 x 5.6: MNT1 -19,0; MNT2 19,0
FIDUCIAL-MICRO = smd 0.635 x 0.635: 1 0,0
STAND-OFF = hole 3.302: 0,0
USB-MICROB-PTH-MILL = smd 0.4 x 1.75: D+ 0,0; D- -0.65,0; GND 1.3,0; ID 0.65,0; VBUS -1.3,0 | smd 2 x 1.46: SHIELD -2.9,0.275; SHIELD2 2.9,0.275 | smd 1.425 x 2.5: SHIELD3 -0.963,-2.675; SHIELD4 0.963,-2.675 | smd 1.4 x 2.1 bottom: SHIELD5 -2.731,-2.531; SHIELD7 2.729,-2.531 | smd 1 x 1: SHIELD6 2.7,-2.575 | smd 1.1 x 1.5: SHIELD8 -2.731,-2.731 | smd 1 x 1.3 bottom: SHIELD9 -2.43,0.195; SHIELD10 2.43,0.195
JST-2-SMD = smd 1 x 4.6: 1 -1,-3.7; 2 1,-3.7 | smd 1.6 x 3.4: NC1 -3.4,1.5; NC2 3.4,1.5
1X04_1MM_RA = smd 0.6 x 1.35: 1 -1.5,0; 2 -0.5,0; 3 0.5,0; 4 1.5,0 | smd 1.2 x 2: NC1 2.8,-3.675; NC2 -2.8,-3.675
1X01_NO_SILK = drill 1.016 pad 1.88: 1 0,0
1X06_NO_SILK = drill 1.016 pad 1.88: 1 0,0; 2 2.54,0; 3 5.08,0; 4 7.62,0; 5 10.16,0; 6 12.7,0
1X03_NO_SILK = drill 1.016 pad 1.88: 1 0,0; 2 2.54,0; 3 5.08,0
U.FL = smd 2.2 x 0.85: 1 0,1.375; 2 0,-1.375 | smd 1.05 x 1: FEED 1.525,0; NC -1.525,0
NANO_SIM_WURTH_693043020611 = smd 0.65 x 1.3: C1 1.905,6.25; C2 -0.635,6.25; C3 -1.905,6.25; C5 3.175,6.25; C6 0.635,6.25; C7 -3.175,6.25 | smd 0.48 x 1.8: MNT1 -4.69,5.58; MNT2 4.66,5.58; MNT3 -4.69,-0.17; MNT4 4.66,-0.17 | smd 1.03 x 1: MNT5 -4.465,-5.89; MNT6 4.465,-5.89
1X02_NO_SILK = drill 1.016 pad 1.88: 1 0,0; 2 2.54,0
SMT-JUMPER_3_NO_SILK = smd 0.635 x 1.27: 1 -0.813,0; 2 0,0; 3 0.813,0
SMT-JUMPER_2_NC_TRACE_SILK = smd 0.635 x 1.27: 1 -0.508,0; 2 0.508,0
SMT-JUMPER_2_NO_SILK = smd 0.635 x 1.27: 1 -0.406,0; 2 0.406,0
SMT-JUMPER_2_NC_TRACE_NO-SILK = smd 0.635 x 1.27: 1 -0.508,0; 2 0.508,0
SMT-JUMPER_2_NO_NO-SILK = smd 0.635 x 1.27: 1 -0.406,0; 2 0.406,0
SOT23-3 = smd 0.8 x 0.9: 1 -0.95,-1; 2 0.95,-1; 3 0,1.1
SWITCH_DPDT_SMD_AYZ0202 = smd 1 x 1.15: 1 -2.5,2.825; 2 0,2.825; 3 2.5,2.825; 4 -2.5,-2.825; 5 0,-2.825; 6 2.5,-2.825 | hole 0.85: 1.5,0; -1.5,0
TACTILE_SWITCH_SMD_5.2MM = smd 1.524 x 0.762: 1 -2.794,1.905; 2 2.794,1.905; 3 -2.794,-1.905; 4 2.794,-1.905
TSSOP14 = smd 0.305 x 0.991: 1 -1.95,-2.918; 2 -1.3,-2.918; 3 -0.65,-2.918; 4 0,-2.918; 5 0.65,-2.918; 6 1.3,-2.918; 7 1.95,-2.918; 8 1.95,2.918; 9 1.3,2.918; 10 0.65,2.918; 11 0,2.918; 12 -0.65,2.918; 13 -1.3,2.918; 14 -1.95,2.918
SOT23-5 = smd 0.55 x 1.2: 1 -0.95,-1.3; 2 0,-1.3; 3 0.95,-1.3; 4 0.95,1.3; 5 -0.95,1.3
VSSOP-8 = smd 0.75 x 0.25: 1 -1.65,0.75; 2 -1.65,0.25; 3 -1.65,-0.25; 4 -1.65,-0.75; 5 1.65,-0.75; 6 1.65,-0.25; 7 1.65,0.25; 8 1.65,0.75
8-UDFN = smd 0.3 x 0.65: 1 -0.975,-1.375; 2 -0.325,-1.375; 3 0.325,-1.375; 4 0.975,-1.375; 5 0.975,1.375; 6 0.325,1.375; 7 -0.325,1.375; 8 -0.975,1.375 | smd 2.35 x 1.6: EP 0,0
SARA-LGA = smd 0.8 x 1.5: 1 -11,-6.95; 2 -9.9,-6.95; 3 -8.8,-6.95; 4 -7.7,-6.95; 5 -6.6,-6.95; 6 -5.5,-6.95; 7 -4.4,-6.95; 8 -3.3,-6.95; 9 -2.2,-6.95; 10 -1.1,-6.95; 11 0,-6.95; 12 1.1,-6.95; 13 2.2,-6.95; 14 3.3,-6.95; 15 4.4,-6.95; 16 5.5,-6.95; 17 6.6,-6.95; 18 7.7,-6.95; 19 8.8,-6.95; 20 9.9,-6.95; 21 11,-6.95; 33 11,6.95; 34 9.9,6.95; 35 8.8,6.95; 36 7.7,6.95; 37 6.6,6.95; 38 5.5,6.95; 39 4.4,6.95; 40 3.3,6.95; 41 2.2,6.95; 42 1.1,6.95; 43 0,6.95; 44 -1.1,6.95; 45 -2.2,6.95; 46 -3.3,6.95; 47 -4.4,6.95; 48 -5.5,6.95; 49 -6.6,6.95; 50 -7.7,6.95; 51 -8.8,6.95; 52 -9.9,6.95; 53 -11,6.95 | smd 1.5 x 0.8: 22 11.95,-5.5; 23 11.95,-4.4; 24 11.95,-3.3; 25 11.95,-2.2; 26 11.95,-1.1; 27 11.95,0; 28 11.95,1.1; 29 11.95,2.2; 30 11.95,3.3; 31 11.95,4.4; 32 11.95,5.5; 54 -11.95,5.5; 55 -11.95,4.4; 56 -11.95,3.3; 57 -11.95,2.2; 58 -11.95,1.1; 59 -11.95,0; 60 -11.95,-1.1; 61 -11.95,-2.2; 62 -11.95,-3.3; 63 -11.95,-4.4; 64 -11.95,-5.5 | smd 1.1 x 1.1: 65 -10.25,-5.25; 66 -10.25,-3.15; 67 -10.25,-1.05; 68 -10.25,1.05; 69 -10.25,3.15; 70 -10.25,5.25; 71 -8.45,-5.25; 72 -8.45,-3.15; 73 -8.45,-1.05; 74 -8.45,1.05; 75 -8.45,3.15; 76 -8.45,5.25; 77 -6.65,-5.25; 78 -6.65,5.25; 79 -3.05,-5.25; 80 -3.05,5.25; 81 3.05,-5.25; 82 3.05,5.25; 83 6.65,-5.25; 84 6.65,5.25; 85 8.45,-5.25; 86 8.45,-3.15; 87 8.45,-1.05; 88 8.45,1.05; 89 8.45,3.15; 90 8.45,5.25; 91 10.25,-5.25; 92 10.25,-3.15; 93 10.25,-1.05; 94 10.25,1.05; 95 10.25,3.15; 96 10.25,5.25

### Placement (x,y rotation side)
B1  30.48,26.67 270 top
C1  7.62,40.39 0 top
C2  26.67,45.09 270 top
C3  7.62,46.25 0 top
C4  26.67,41.27 90 top
C5  13.46,11.05 180 top
C6  12.7,21.21 0 top
C7  15.75,18.41 90 top
C8  37.59,22.86 90 top
C9  39.12,22.86 90 top
C10  40.64,22.86 90 top
C11  42.16,22.86 90 top
C12  17.78,19.05 90 top
C13  25.02,8.26 270 top
C14  26.67,8.26 270 top
C15  39.37,27.18 0 top
C16  45.34,30.48 0 top
C17  20.45,8.26 270 top
C18  21.97,8.26 270 top
C19  44.45,27.18 0 top
C20  23.5,8.26 270 top
D1  8.26,19.05 0 top
D2  1.91,25.15 0 top
D3  17.53,11.05 0 top
D4  1.91,23.62 180 top
D5  1.91,26.67 0 top
D6  31.75,7.87 90 top
E1  63.5,32.64 270 top
FD1  67.44,0.64 0 bottom
FD2  3.17,52.58 0 bottom
FD3  3.17,52.58 0 top
FD4  67.44,0.64 0 top
FRAME1  5.08,-25.4 0 top  (outside the outline)
FRAME2  5.08,-25.4 0 top  (outside the outline)
H1  57.02,7.62 0 top
H2  5.08,2.54 0 top
H3  6.35,50.8 0 top
J1  5.08,18.92 270 top
J2  3.56,9.65 90 top
J3  5.08,34.29 270 top
J4  6.35,30.48 0 top
J5  1.27,52.07 270 top
J6  46.99,40.64 90 top
J7  44.45,40.64 90 top
J8  52.7,27.18 180 top
J9  26.67,15.24 90 top
J10  3.17,35.69 270 bottom
J11  1.27,8.38 90 top
JP1  27.94,6.35 0 bottom
JP2  39.81,45.72 270 bottom
JP3  37.27,45.72 270 bottom
JP4  49.4,45.72 0 bottom
JP5  42.04,43.18 180 bottom
JP6  19.05,6.35 270 bottom
JP7  48.51,26.29 270 top
JP8  49.28,27.18 0 top
L1  41.91,28.03 270 top
L2  46.9,28.07 90 top
LOGO1  33.53,10.41 0 top
LOGO2  64.77,2.54 0 top
LOGO3  43.18,29.21 0 bottom
Q1  17.53,13.59 270 top
Q2  3.81,29.21 270 top
R1  7.62,38.86 0 top
R2  7.37,25.15 180 top
R3  11.43,13.97 90 top
R4  17.4,9.53 0 top
R5  7.37,23.62 0 top
R6  1.27,29.21 270 top
R7  7.37,26.67 180 top
R8  44.45,32.89 270 top
S1  37.47,43.18 180 top
S2  13.26,3.81 180 top
S3  19.05,43.18 270 top
S4  12.7,43.18 270 top
U1  30.48,43.18 0 top
U2  7.62,43.18 0 top
U3  13.97,13.97 0 top
U4  24.13,43.18 90 top
U5  12.7,18.54 90 top
U6  22.86,30.48 180 top
U$1  [SCL0]  8.51,49.02 0 top
U$2  [SDA1]  11.05,49.02 0 top
U$3  [AREF2]  15.62,50.04 270 top
U$4  [GND3]  16,49.02 0 top
U$5  [134]  19.05,49.02 0 top
U$6  [125]  21.72,49.02 0 top
U$7  [116]  24.13,49.02 0 top
U$8  [107]  26.8,49.02 0 top
U$9  [98]  29.46,49.02 0 top
U$10  [89]  32,49.02 0 top
U$11  [RESET48]  10.29,47.5 0 top
U$12  [GPS47]  6.6,32.51 90 top
U$13  [714]  35.94,49.4 0 top
U$14  [615]  38.35,49.4 0 top
U$15  [516]  41.02,49.02 0 top
U$16  [417]  43.43,49.02 0 top
U$17  [318]  45.85,49.02 0 top
U$18  [219]  48.51,49.02 0 top
U$19  [POWER49]  16.26,47.5 0 top
U$20  [RX22]  53.21,49.02 0 top
U$21  [TX21]  50.67,49.02 0 top
U$22  [SERIAL57]  34.67,48.26 0 top
U$23  [CTS23]  42.95,43.89 90 top
U$24  [DTR24]  42.95,41.48 90 top
U$25  [RI25]  42.95,39.45 90 top
U$26  [DSR26]  48.51,38.94 90 top
U$27  [DCD27]  48.51,41.48 90 top
U$28  [RTS28]  48.51,44.02 90 top
U$29  [VIO29]  2.03,44.45 0 top
U$30  [RX22]  2.03,46.99 0 top
U$31  [TX21]  2.03,49.53 0 top
U$32  [LTE_CAT_M1#NB#IOT_SHIELD1]  40.26,29.72 0 bottom
U$33  [ARDUINO51]  9.02,0.64 90 top
U$34  [IO334]  7.87,28.96 90 top
U$35  [NET31]  2.9,26.67 0 top
U$36  [CHG33]  2.92,25.15 0 top
U$37  [PWR32]  2.74,23.62 0 top
U$38  [PWR#SEL53]  10.16,8 0 top
U$39  [SHIELD52]  17.4,1.27 90 top
U$40  [RST0]  24.13,3.17 90 top
U$41  [IOREF39]  21.59,2.92 90 top
U$42  [RST0]  24.13,3.17 90 bottom
U$43  [3#3V41]  26.67,3.2 90 top
U$44  [5V42]  29.21,3.2 90 top
U$45  [GND3]  31.75,3.05 90 top
U$46  [GND3]  34.29,3.3 90 top
U$47  [VIN43]  36.83,3.2 90 top
U$48  [A044]  41.91,3.2 90 top
U$49  [A145]  44.45,3.2 90 top
U$50  [A246]  46.99,3.2 90 top
U$51  [A347]  49.53,3.2 90 top
U$52  [A448]  52.07,3.2 90 top
U$53  [A549]  54.61,3.2 90 top
U$54  [NANO50]  33.4,19.18 0 top
U$55  [SIM51]  34.09,18.03 0 top
U$56  [IOREF39]  30.1,8 0 bottom
U$57  [5V42]  31.75,6.35 0 bottom
U$58  [3#3V41]  26.92,6.35 0 bottom
U$59  [PWR32]  39.88,41.27 90 bottom
U$60  [RST40]  37.21,41.66 90 bottom
U$61  [516]  39.88,46.35 90 bottom
U$62  [615]  37.34,46.35 90 bottom
U$63  [DTR24]  42.04,43.69 90 bottom
U$64  [RTS28]  49.4,41.78 90 bottom
U$65  [VUSB_DET52]  18.54,6.35 0 bottom
U$66  [A549]  54.61,3.2 90 bottom
U$67  [A448]  52.07,3.2 90 bottom
U$68  [A347]  49.53,3.2 90 bottom
U$69  [A246]  46.99,3.2 90 bottom
U$70  [A145]  44.45,3.2 90 bottom
U$71  [A044]  41.91,3.2 90 bottom
U$72  [VIN43]  36.83,3.2 90 bottom
U$73  [GND3]  34.29,3.3 90 bottom
U$74  [GND3]  31.75,3.3 90 bottom
U$75  [5V42]  29.21,3.2 90 bottom
U$76  [3#3V41]  28.55,4.32 0 bottom
U$77  [LTE_CAT_M1#NB#IOT_SHIELD1]  36.32,10.92 0 top
U$78  [IOREF39]  21.59,2.92 90 bottom
U$79  [IO334]  7.87,28.96 90 bottom
U$80  [TX21]  4.95,49.53 0 bottom
U$81  [RX22]  4.83,46.99 0 bottom
U$82  [VIO29]  5.33,44.45 0 bottom
U$83  [HTTPS###SFE#IO#T8160]  41.78,24.51 0 bottom
U$84  [SDA1]  14.48,49.02 0 bottom
U$85  [SCL0]  11.81,49.02 0 bottom
U$86  [AREF2]  15.24,50.04 270 bottom
U$87  [134]  21.59,49.02 0 bottom
U$88  [GND3]  19.68,49.02 0 bottom
U$89  [125]  24,49.02 0 bottom
U$90  [116]  26.67,49.02 0 bottom
U$91  [107]  29.21,49.02 0 bottom
U$92  [98]  31.37,49.02 0 bottom
U$93  [89]  34.04,49.02 0 bottom
U$94  [714]  37.85,49.02 0 bottom
U$95  [615]  40.39,49.02 0 bottom
U$96  [516]  42.93,49.02 0 bottom
U$97  [417]  45.47,49.02 0 bottom
U$98  [318]  48.01,49.02 0 bottom
U$99  [219]  50.55,49.02 0 bottom
U$100  [TX21]  53.59,49.02 0 bottom
U$101  [RX22]  56.01,49.02 0 bottom
U$102  [SOFT#HARD50]  33.27,47.24 0 top
U$103  [NC0]  2.03,52.07 0 top
U$104  [GND3]  2.03,39.37 0 top
U$105  [GND3]  5.71,39.37 0 bottom
U$106  [NC0]  5.08,52.07 0 bottom
U$107  [NC0]  2.03,41.91 0 top
U$108  [NC0]  5.08,41.91 0 bottom
U$109  [GPS#SCL1]  10.03,33.02 0 bottom
U$110  [GPS#SDA0]  10.16,35.56 0 bottom
U$111  [VBAT2]  6.22,10.92 0 bottom
U$112  [GND3]  5.71,8.38 0 bottom

### Tracks (layer width: path | path; a pad name or v marks a point on that pad's centre or on a via)
1.8V  (via drill 0.3)
  Top 0.152: U6.4 30.56,38.75 v30.77,38.96 | U4.3 24.38,42.08 24.38,42.16 | U4.6 24.38,42.16 | 24.38,42.16 25.07,42.16 25.83,41.4 26.67,40.56 C4.1 26.84,40.26 v27.79,40.26 27.79,40.87 28.24,41.32 28.53,41.32 | U1.1 28.53,41.32 | U1.8 32.43,45.22 28.53,41.32
  Bottom 0.152: v30.77,38.96 29.48,40.26 v27.79,40.26
3.3V  (via drill 0.3)
  Top 0.152: D5.A 1.71,27.36 v1.91,27.36 | R5.2 8.22,22 8.89,22
  Top 0.305: U5.1 C7.1 | 17.7,17.57 C12.1 17.9,17.65 | U6.51 31.66,22.86 | 32.76,22.01 33.02,22.01 | 33.86,22.01 34.29,22.01 | 5.59,40.39 5.59,37.82 6.64,36.76 6.64,32.6 v7.14,32.1 | 5.59,40.39 5.59,41.4 6.07,41.88 U2.1 | C1.1 5.59,40.39 | 31.66,22.01 31.75,22.01 | v10.16,22 8.89,22 7.86,22 v7.61,21.74
  Top 0.508: C7.1 17.7,17.57 | C11.1 C10.1 C9.1 C8.1 34.29,22.01 33.02,22.01 31.75,22.01 30.7,20.95 19.56,20.95 19.18,20.57 v19.18,18.92 17.9,17.65 | U6.52 32.76,22.01 | U6.53 33.86,22.01 | 31.66,22.86 31.66,22.01
  Bottom 0.152: v1.91,27.36 3.29,28.73 7.61,28.73 7.61,29.21
  Bottom 0.305: v19.18,18.92 17.75,20.35 13.5,20.35 11.86,22 v10.16,22 | v7.14,32.1 7.66,31.59 7.66,29.72 7.61,29.67 7.61,29.21 v7.61,21.74
ANT
  Top 0.254: C15.1 37.98,27.18 37.97,27.18
  Top 0.762: 36.2,27.18 36.19,27.18 U6.56
  Top 1.27: 37.97,27.18 36.2,27.18
ANT_DET
  Top 0.508: U6.62 44.41,33.78 R8.1
ARDUINO-3.3V
  Bottom 0.152: JP1.3 27.13,3 B1.3.3V
ARDUINO-5V  (via drill 0.3)
  Top 0.305: S2.5 13.22,6.59 13.26,6.55
  Top 0.508: S2.2 13.26,3.61 13.26,5.08 | v16.48,5.08 26.67,5.08 B1.5V | 13.26,5.08 13.26,6.55 | v13.97,5.08 13.26,5.08
  Bottom 0.152: JP1.1 28.75,3 B1.5V
  Bottom 0.508: v16.48,5.08 v13.97,5.08
CTS  (via drill 0.3)
  Top 0.152: U6.11 v22.86,36.2
  Bottom 0.152: 42.44,45.72 43.18,45.72 | 43.18,45.72 J7.3 | 42.44,45.72 43.18,45.72 | 42.44,45.72 41.07,44.35 40.99,44.35 40.68,44.04 40.68,43.95 34.67,37.95 24.61,37.95 v22.86,36.2
D+  (via drill 0.3)
  Top 0.254: D1.4 9.01,18.55 9.25,18.31 9.25,17.96 9.09,17.8 v8.69,17.8
  Top 0.508: U6.29 v9.33,28.28
  Bottom 0.508: v9.33,28.28 9.33,18.45 v8.69,17.8
D-  (via drill 0.3)
  Top 0.254: D1.6 9.01,19.55 9.2,19.74 9.2,19.96 9.01,20.15 v8.49,20.15
  Top 0.762: U6.28 v9.34,29.38
  Bottom 0.508: v8.49,20.15 8.49,28.53 v9.34,29.38
DCD  (via drill 0.3)
  Top 0.152: U6.8 26.16,36.99 v26.92,36.23
  Bottom 0.152: J6.2 45.72,41.91 43.61,41.91 43.31,41.6 39.62,41.6 36.47,38.46 35.05,37.03 27.73,37.03 v26.92,36.23
DSR  (via drill 0.3)
  Top 0.152: U6.6 28.36,36.27 v28.44,36.2
  Bottom 0.152: J6.1 45.72,39.37 38.25,39.37 35.3,36.42 30.5,36.42 28.67,36.42 v28.44,36.2
DTR  (via drill 0.3)
  Top 0.152: U6.9 25.06,36.49 v24.77,36.2
  Bottom 0.152: JP5.2 J7.2 43.18,41.91 39.5,41.91 36.17,38.58 34.92,37.34 25.91,37.34 v24.77,36.2
GND  (via drill 0.3)
  Top 0.152: U6.71 U6.65 | R3.1 v11.43,12.06
  Top 0.254: U2.2 7.62,41.24 C1.2 | D4.C 1.89,24.48 v1.91,24.48
  Top 0.305: U6.50 30.56,24.48 U6.76 | J1.GND 6.48,17.62 v6.6,17.75 | U6.14 19.56,35.98 U6.81
  Top 1.27: E1.GND 52.7,22.14
  other vias: 18.73,41 4.75,36.65 6.38,37.9 7.62,43.18 14.61,41.73 13.59,46.43 19.94,46.35 20.9,41.76 32.21,34.68 32.21,32.58 32.21,28.38 32.21,30.48 32.21,26.28 28,30.48 30.1,33.63 4.32,25.75 3.94,28.16 13.97,13.94 11.43,10.89 40.64,42.52 10.84,36.97 20.17,38.89 36.53,28.51 37.58,29.43 36.53,30.48 37.58,31.53 36.53,32.58 37.58,28.51 38.63,28.51 39.68,28.51 40.73,28.51 39.68,29.43 38.63,30.48 39.68,31.53 38.63,32.58 37.58,32.58 39.68,32.58 40.73,32.58 41.78,32.58 42.83,32.58 40.73,30.48 41.78,31.53 42.83,31.53 42.95,30.48 42.96,29.49 42.96,28.51 44.01,28.51 45.06,28.51 44.01,29.43 36.53,25.81 37.58,25.81 38.63,25.81 39.68,25.81 40.73,25.81 41.78,25.81 42.83,25.81 43.88,25.81 44.93,25.81 45.98,25.81 47.03,25.81 47.03,24.89 47.41,23.84 47.79,22.79 48.42,21.74 49.31,20.69 50.71,19.64 53.87,18.74 52.15,18.99 55.57,18.76 49.94,25.85 50.07,24.93 50.45,23.88 51.09,22.83 52.1,22.03 53.37,21.65 54.42,21.65 55.47,21.65 54.68,22.7 53.37,23.75 55.47,23.75 52.91,22.71 51.89,23.73 55.47,25.85 55.47,27.95 55.47,30.05 55.47,32.15 55.47,34.25 55.47,36.35 55.47,38.45 55.47,40.55 55.47,42.65 55.47,44.75 55.47,46.85 55.47,48.95 53.37,31.1 53.37,33.2 53.37,35.3 53.37,37.4 53.37,39.5 53.37,41.6 53.37,43.7 53.37,45.8 53.37,47.9 49.17,31.1 49.17,33.2 49.17,35.3 49.17,37.4 49.17,39.5 49.17,41.6 49.17,43.7 49.17,47.9 51.27,30.05 51.27,32.15 51.27,34.25 51.27,36.35 51.27,38.45 51.27,40.55 51.27,42.65 51.27,44.75 51.27,46.85 47.07,47.9 47.07,32.15 47.07,34.25 47.07,36.35 47.07,38.45 44.97,35.3 44.97,37.4 42.87,38.7 42.87,36.6 42.87,34.5 36.57,36.6 36.57,34.5 38.67,38.7 38.67,36.6 38.67,34.5 40.77,38.7 40.77,36.6 40.77,34.5 47.95,28.51 49.01,28.51 50.05,28.51 50.98,28.51 49.17,30.05 47.45,30.08 45.55,32.15 45.55,34.25 55.57,16.66 55.57,14.56 55.57,12.46 55.57,10.36 54.64,8.26 55.02,6.16 53.47,15.61 53.47,13.51 53.47,11.41 53.47,9.31 53.47,7.21 53.47,17.71 51.37,16.66 51.37,14.56 51.37,12.46 51.37,10.36 51.37,8.26 51.37,6.16 47.17,16.66 47.17,14.56 47.17,12.46 47.17,10.36 47.17,8.26 47.17,6.16 47.17,18.76 47.17,20.86 45.07,19.81 49.27,17.71 49.27,15.61 49.27,13.51 49.27,11.41 49.27,9.31 49.27,7.21 45.07,21.91 45.07,24.01 45.07,17.71 45.07,15.61 45.07,13.51 45.07,11.41 45.07,9.31 45.07,7.21 42.97,16.66 42.97,14.56 42.97,12.46 42.97,10.36 42.97,8.26 42.97,6.16 42.97,18.76 42.97,20.86 36.67,17.71 36.79,14.98 36.67,13.51 36.67,11.41 36.67,9.31 36.67,7.21 36.67,19.81 38.77,16.66 38.77,14.56 38.77,12.46 38.77,10.36 38.77,8.26 38.77,6.16 38.77,18.76 38.77,20.86 40.87,17.71 40.87,15.61 40.87,13.51 40.87,11.41 40.87,9.31 40.87,7.21 40.87,19.81 28,32.58 28,34.55 28,28.38 28,26.41 30.1,31.53 30.1,29.43 30.1,27.33 15.53,33.63 15.53,31.54 15.53,29.43 15.53,27.34 23.94,30.51 23.94,32.61 23.94,34.58 23.94,28.41 23.94,26.44 21.82,33.63 21.82,31.54 21.82,29.43 21.82,27.34 26.02,33.63 26.02,31.54 26.02,29.43 26.02,27.34 19.74,30.51 19.74,32.61 19.74,34.58 19.74,28.41 19.74,26.44 17.62,33.63 17.62,31.54 17.62,29.43 17.62,27.34 13.5,34.69 13.5,32.59 13.5,28.39 13.5,30.48 13.5,26.29 17.62,35.73 17.62,25.23 21.82,25.23 23.94,24.84 28,24.82 21.82,35.73 35.13,23.4 10.87,23.91 6.91,18.97 34.05,7.87 29.43,7.87 23.5,5.79 19.48,8.31 17.37,7.47 10.31,8.66 4.29,8.66 19.96,19.25 22.61,18.47 3.05,51.64 55.63,0.6 53.09,0.6 50.55,0.6 48.01,0.6 45.47,0.6 42.93,0.6 40.39,0.6 37.85,0.6 35.31,0.6 32.77,0.6 30.23,0.6 27.69,0.6 25.15,0.6 22.61,0.6 20.07,0.6 17.53,0.6 9.79,0.6 7.25,0.6 2.8,0.6 1.66,1.74 0.64,2.76 0.64,4.92 0.64,32.6 0.64,35.9 0.64,34.29 4.58,52.67 8.01,52.67 10.55,52.67 13.09,52.67 15.63,52.67 18.17,52.67 20.71,52.67 23.25,52.67 25.79,52.67 28.33,52.67 30.87,52.67 33.41,52.67 35.95,52.67 38.49,52.67 41.03,52.67 43.57,52.67 46.11,52.67 48.65,52.67 51.19,52.67 53.73,52.67 55.63,52.67 30.02,38.63 26.69,43.16 23.8,40.52 32.33,41.41 25.6,45.09 21.34,43.21
  pour Top (isolate 0.152, rank 6): 0,53.34 0,2.54 2.54,0 55.88,0 55.88,53.34
  pour Bottom (isolate 0.152, rank 6): 0,53.34 0,2.54 2.54,0 55.88,0 55.88,53.34
  cutout Top (isolate 0.152): 35.7,26.17 51.7,26.17 51.7,27.5 51.7,28.13 35.7,28.13 35.7,27.8 33.9,27.8 33.8,27.8 33.8,26.5 35.7,26.5
  cutout Bottom (isolate 0.152): 35.7,26.17 51.7,26.17 51.7,27.5 51.7,28.13 35.7,28.13 35.7,27.8 33.9,27.8 33.8,27.8 33.8,26.5 35.7,26.5
  cutout Top (isolate 0.152): 47.5,26.3 47.5,25.7 arc90 54.1,19.1 56,19.1 56,21.2 54.1,21.2 arc-90 49.6,25.7 49.6,26.3
  cutout Bottom (isolate 0.152): 47.5,26.3 47.5,25.7 arc90 54.1,19.1 56,19.1 56,21.2 54.1,21.2 arc-90 49.6,25.7 49.6,26.3
GPIO1  (via drill 0.3)
  Top 0.152: R6.2 2.44,29.53 v3.81,29.53 | U6.16 17.36,38.6 15.49,40.47 v15.46,40.47
  Bottom 0.152: v3.81,29.53 3.81,31.11 8.42,35.73 8.42,38.58 9.73,39.89 14.5,39.89 15.08,40.47 v15.46,40.47
GPIO2  (via drill 0.3)
  Top 0.152: U6.23 9.13,34.88 8.47,35.53 8.47,36.37 | 8.47,36.37 R1.2 | U2.3 v8.57,42.94 | v7.28,36.35 8.45,36.35 8.47,36.37
  Bottom 0.152: v8.57,42.94 8.57,40.02 7.51,38.95 7.51,36.58 v7.28,36.35
GPIO3-CELL  (via drill 0.3)
  Top 0.152: U6.24 9.86,33.78 v9.69,33.95 | U1.2 v29.18,41.22
  Bottom 0.152: v9.69,33.95 10.25,34.5 10.25,37.12 11.27,38.14 16.48,38.14 17.79,39.46 24.41,39.46 26.18,41.22 v29.18,41.22
GPIO3-QWIIC  (via drill 0.3)
  Top 0.152: v29.18,43.54 U1.13
  Bottom 0.152: J4.1 6.35,33.22 8.72,35.6 8.72,38.45 9.86,39.59 15.56,39.59 16.34,40.37 21.41,40.37 24.41,43.37 24.41,43.39 24.79,43.76 28.96,43.76 v29.18,43.54
GPS-3.3V
  Top 0.254: J3.2 5.96,34.79 6.21,35.04 6.21,36.58 5.11,37.69 5.11,45.74 5.61,46.25 C3.1
  Top 0.305: C3.1 6.67,46.25 U2.5
HARDRX-ARDUINO
  Top 0.152: B1.RX 52.59,48.78 44.45,48.78 43.17,48.78 40.69,46.3 40.69,45.27 39.97,44.54 S1.1
HARDTX-ARDUINO
  Top 0.152: S1.4 43.05,49.09 50.35,49.09 B1.TX
IOREF  (via drill 0.3)
  Top 0.152: v10.37,38.05 9.94,38.47 9.94,46.98 9.96,46.99 | J5.4 3.81,46.99 9.96,46.99 | U1.14 28.52,46.71 28.25,46.99 26.67,46.99 | 9.96,46.99 23.88,46.99 | 23.88,46.99 26.67,46.99 | U4.7 23.88,46.99 | C2.1 26.67,46.99
  Bottom 0.152: v10.37,38.05 9.94,37.62 9.94,34.95 9.16,34.17 9.16,32.95 10.17,31.94 10.17,29.73 10.17,25.92 15.06,21.04 19.4,21.04 20.83,19.61 20.83,7.87 | JP1.2 27.94,7.49 27.56,7.87 20.83,7.87 | B1.IOREF 20.83,3.3 20.83,7.87
N$1
  Top 0.152: U3.5 13.02,14.82 R3.2
N$7
  Top 0.508: R8.2 44.49,32 C16.1 44.49,30.31 45.89,28.92 L2.2
N$8
  Top 0.254: C15.2 40.33,27.18 | C19.1 43.05,27.18
  Top 1.27: 40.33,27.18 40.34,27.18 L1.2 43.51,27.18 43.05,27.18
N$9
  Top 0.254: 50.22,27.18 JP8.2
  Top 1.016: J8.FEED 50.01,27.18 50.21,27.18 50.22,27.18
N$10
  Top 0.152: R6.1 1.37,30.16 Q2.1
N$11
  Top 1.27: 48.51,26.04 48.51,26.42
N$12
  Top 0.254: J1.D- 5.1,19.55 6.67,19.55 7.15,19.55 D1.1
N$13
  Top 0.152: R7.2 D5.C
N$14
  Top 0.254: D1.3 7.31,18.55 7.15,18.39 6.67,18.39 6.13,18.92 J1.D+
N$15
  Top 0.152: Q2.3 5.68,29.21 R7.1
N$16
  Top 0.152: R5.1 D4.A
N$17
  Top 0.152: R2.2 D2.C
N$18  (via drill 0.3)
  Top 0.152: U3.1 v13.02,13.97 | v10.7,21.36 10.7,22.66 R2.1
  Bottom 0.152: v13.02,13.97 13.02,17.21 10.26,19.97 10.26,20.92 | 10.26,20.92 | 10.26,20.92 v10.7,21.36
N$19
  Bottom 0.152: JP2.1 39.81,48.7 B1.D5
N$20
  Bottom 0.152: JP3.1 37.27,48.7 B1.D6
N$21
  Top 0.254: JP8.1 48.51,27.18 48.51,27.22 | 48.26,27.22 48.26,27.05 JP7.1 | C19.2 45.39,27.18
  Top 0.508: 46.87,27.18 L2.1
  Top 1.016: L2.1 48.26,27.22 48.51,27.22 48.51,27.15
  Top 1.27: 45.39,27.18 46.87,27.18
N$22
  Top 1.27: JP7.2 arc90 54.16,20.14 E1.FEED
PWR_ON  (via drill 0.3)
  Top 0.152: S3.3 v17.14,43.85 S3.4 17.14,40.01 18.46,38.69 U6.15
  Bottom 0.152: v17.14,43.85 17.36,44.07 38.36,44.07 39.51,45.21 JP2.2
RESET_N  (via drill 0.3)
  Top 0.152: U6.18 15.16,38.74 14.7,39.2 12.68,39.2 11.49,40.39 S4.4 v10.79,43.18 S4.3
  Bottom 0.152: JP3.2 36.83,45.21 36,44.39 13.91,44.39 12.7,43.18 v10.79,43.18
RI  (via drill 0.3)
  Top 0.152: U6.7 27.26,36.64 27.45,36.45 27.45,36.42 v27.68,36.2
  Bottom 0.152: v27.68,36.2 28.21,36.73 35.17,36.73 36.69,38.24 39.09,40.64 J7.1
RTS  (via drill 0.3)
  Top 0.152: U6.10 24,37.39 v24,36.2
  Bottom 0.152: 41.6,44.45 41.91,44.45 | 41.91,44.45 45.72,44.45 J6.3 JP4.2 | 41.6,44.45 41.91,44.45 | 41.6,44.45 41.2,44.04 41.12,44.04 40.98,43.91 40.98,43.83 34.8,37.64 25.45,37.64 v24,36.2
RX-ARDUINO  (via drill 0.3)
  Top 0.152: S1.2 37.47,43.62 36.13,44.95 36.13,45.72 | 36.13,45.72 36.13,46.23 | 36.13,46.23 36.13,45.72 | v34.13,48.41 34.13,48.23 34.77,47.59 34.95,47.59 35.69,46.85 35.69,46.67 36.13,46.23 | v29.82,47.6 29.83,47.59 U1.12
  Bottom 0.152: v34.13,48.41 33.33,47.6 v29.82,47.6 3.2,47.6 J5.2
RX-CELL
  Top 0.152: U6.12 21.76,38.4 22.53,39.17 30.23,39.17 30.48,39.42 U1.4
SCL-CELL  (via drill 0.3)
  Top 0.152: U6.27 v9.34,30.48 | U4.5 24.88,43.23 v24.94,43.17
  Bottom 0.152: v24.94,43.17 21.84,40.07 16.47,40.07 15.68,39.28 9.99,39.28 9.03,38.32 9.03,35.33 8.24,34.55 8.24,31.57 v9.34,30.48
SCL-QWIIC  (via drill 0.3)
  Top 0.152: v23.52,43.54 23.38,43.68 U4.8 | J3.4 3.53,32.79 J10.2
  Bottom 0.152: v23.52,43.54 23.52,43.08 22.73,42.29 16.41,42.29 14.31,40.2 9.61,40.2 8.12,38.7 8.12,35.91 5.24,33.04 3.28,33.04 J10.2
SDA-CELL  (via drill 0.3)
  Top 0.152: U6.26 v9.34,31.58 | v24.89,40.69 24.89,41.52 U4.4
  Bottom 0.152: v24.89,40.69 23.96,39.76 16.59,39.76 15.81,38.98 10.11,38.98 9.34,38.2 9.34,35.21 8.55,34.42 8.55,32.37 v9.34,31.58
SDA-QWIIC  (via drill 0.3)
  Top 0.152: v22.21,42.82 22.84,42.82 23.38,42.28 U4.1 | J3.3 4.69,33.79 3.17,35.31 J10.1
  Bottom 0.152: v22.21,42.82 21.98,42.6 16.28,42.6 14.19,40.5 9.48,40.5 7.81,38.83 7.81,36.04 7.46,35.69 J10.1
SHIELD  (via drill 0.3)
  other vias: 0.64,21.59 0.64,19.05 0.64,16.51
  pour Top (isolate 0.254): 0,15.11 5.84,15.11 5.84,22.71 0,22.71
  pour Bottom (isolate 0.254): 0,15.11 5.84,15.11 5.84,22.71 0,22.71
SIM_CLK  (via drill 0.3)
  Top 0.152: U6.38 v17.36,22.29 | J9.C3 v21.72,13.34 22.46,12.6 22.47,12.6 22.78,12.29 22.78,9.91 C18.1 | v26.67,11.43 27.42,11.43 27.99,10.86 27.99,9.88 28.9,8.98 28.9,7.4 29.37,6.92 D6.6
  Bottom 0.152: v17.36,22.29 18.31,21.34 19.05,21.34 19.53,21.34 21.13,19.74 21.13,13.92 v21.72,13.34 21.72,11.85 22.13,11.43 v26.67,11.43
SIM_IO  (via drill 0.3)
  Top 0.152: U6.39 v18.46,22.29 | v22.25,12.06 J9.C7 20.42,11.53 19.68,10.79 19.68,9.87 C17.1 | D6.4 29.48,8.82 28.3,10.01 28.3,10.99 27.32,11.96 v26.13,11.96
  Bottom 0.152: v18.46,22.29 19.1,21.64 19.66,21.64 21.44,19.86 21.44,14.37 22.25,13.55 22.25,12.6 v22.25,12.06 22.86,12.06 26.02,12.06 v26.13,11.96
SIM_RST  (via drill 0.3)
  Top 0.152: U6.40 v19.56,22.23 | J9.C2 v21.97,14.61 23.5,13.08 C20.1 | D6.3 33.72,8.82 33.91,9.02 33.91,11.15 32.56,12.5 25.79,12.5 v25.68,12.6
  Bottom 0.152: v19.56,22.23 19.56,22.1 19.71,21.95 19.78,21.95 21.74,19.99 21.74,14.83 v21.97,14.61 21.97,14.26 23.64,12.6 v25.68,12.6
SOFTRX-ARDUINO  (via drill 0.3)
  Top 0.152: S1.3 34.97,44.72 v34.73,44.96 | B1.D8 33.02,48.77 v34.73,47.06
  Bottom 0.152: v34.73,44.96 v34.73,47.06
SOFTTX-ARDUINO
  Top 0.152: B1.D9 33.78,47.5 33.78,47.25 34.97,46.06 S1.6
TX-ARDUINO  (via drill 0.3)
  Top 0.152: v30.48,47.07 U1.11 | v34.99,48.12 35.35,48.12 S1.5
  Bottom 0.152: v34.99,48.12 33.93,47.07 v30.48,47.07 1.35,47.07 J5.3
TX-CELL
  Top 0.152: U1.3 29.83,39.58 29.72,39.47 22.39,39.47 21.63,38.71 21.04,38.71 20.66,38.34 U6.13
V_BATT  (via drill 0.3)
  Top 0.508: v16.27,13.5 15.4,13.5 14.92,13.02 U3.3 14.92,11.66 C5.1 14.31,10.88 13.51,10.08 11,10.08 10.43,10.65 J2.2 1.54,10.65 J11.2 | Q1.3 17.7,14.51 v17.43,14.51
  Bottom 0.508: v17.43,14.51 16.42,13.5 v16.27,13.5
V_USB  (via drill 0.3)
  Top 0.152: D2.A 1.79,25.91 v1.91,25.91
  Top 0.254: D1.5 9.79,19.05
  Top 0.305: 14.92,16.51 15.24,16.51 | Q1.1 16.53,14.41 | J1.VBUS 6.3,20.22 v6.43,20.35
  Top 0.508: Q1.1 16.53,15.73 15.75,16.51 15.24,16.51 10.91,16.51 9.79,17.63 9.79,17.78 9.79,19.05 9.79,20.4 9.33,20.86 6.93,20.86 v6.43,20.35 | U3.4 14.92,16.51 | S2.3 10.76,2.54 S2.6 12.38,8.26 v14.78,8.26 | v18.25,8.26 R4.2 18.25,10.62 D3.A 18.68,11.93 17.53,13.08 17.53,13.41 16.53,14.41
  Bottom 0.152: v6.43,20.35 6.43,22.53 6.08,22.88 5.14,23.81 3.05,25.91 v1.91,25.91 | v18.25,8.26 19.05,7.45 JP6.1
  Bottom 0.508: v14.78,8.26 v18.25,8.26
VIN  (via drill 0.3)
  Top 0.305: Q1.2 16.38,12.49 | 11.68,21.21 C6.1 | U5.8 10.83,17.57 | U5.5 10.46,19.52 10.45,19.51 | 15.49,10.17 15.49,10.16 15.49,10.17
  Top 0.508: 16.38,12.49 16.38,11.43 | 16.38,11.43 D3.C 15.49,10.17 | 11.68,21.21 v10.79,20.32 10.45,19.97 10.45,19.51 10.45,17.95 10.83,17.57 | v15.65,11.87 16.38,11.87 16.38,11.43 | 15.49,10.16 15.49,6.9 S2.4 S2.1
  Bottom 0.305: 10.79,20.17 v10.79,20.32
  Bottom 0.508: 10.79,20.17 13.58,17.39 15.55,15.41 15.55,11.97 v15.65,11.87
VSIM  (via drill 0.3)
  Top 0.152: U6.41 v20.66,22.23 | J9.C1 v22.29,17.14 22.29,15.04 24.64,12.69 25.02,12.69 | C14.1 C13.1 25.02,12.69 | D6.1 34.11,6.92 34.58,7.4 34.58,8.47 34.21,8.84 34.21,11.28 32.36,13.13 25.46,13.13 25.02,12.69
  Bottom 0.152: v22.29,17.14 22.05,17.39 22.05,20.11 20.66,21.5 v20.66,22.23
VUSB_DET  (via drill 0.3)
  Top 0.152: U6.17 v16.26,38.67
  Bottom 0.152: v16.26,38.67 10.24,38.67 10.04,38.47 9.64,38.07 9.64,35.08 8.85,34.29 8.85,32.83 9.87,31.82 9.87,31.8 9.87,29.6 9.87,28.06 9.87,25.8 14.93,20.73 19.28,20.73 20.52,19.48 20.52,6.4 20.07,5.94 JP6.2

### Text on the board
Bottom: v11
Measures: Units in inches
tDocu: Jim Lindblom